# Altium project radxa_cm3_io_board_v1330.PrjPcb (part 1 of 4)
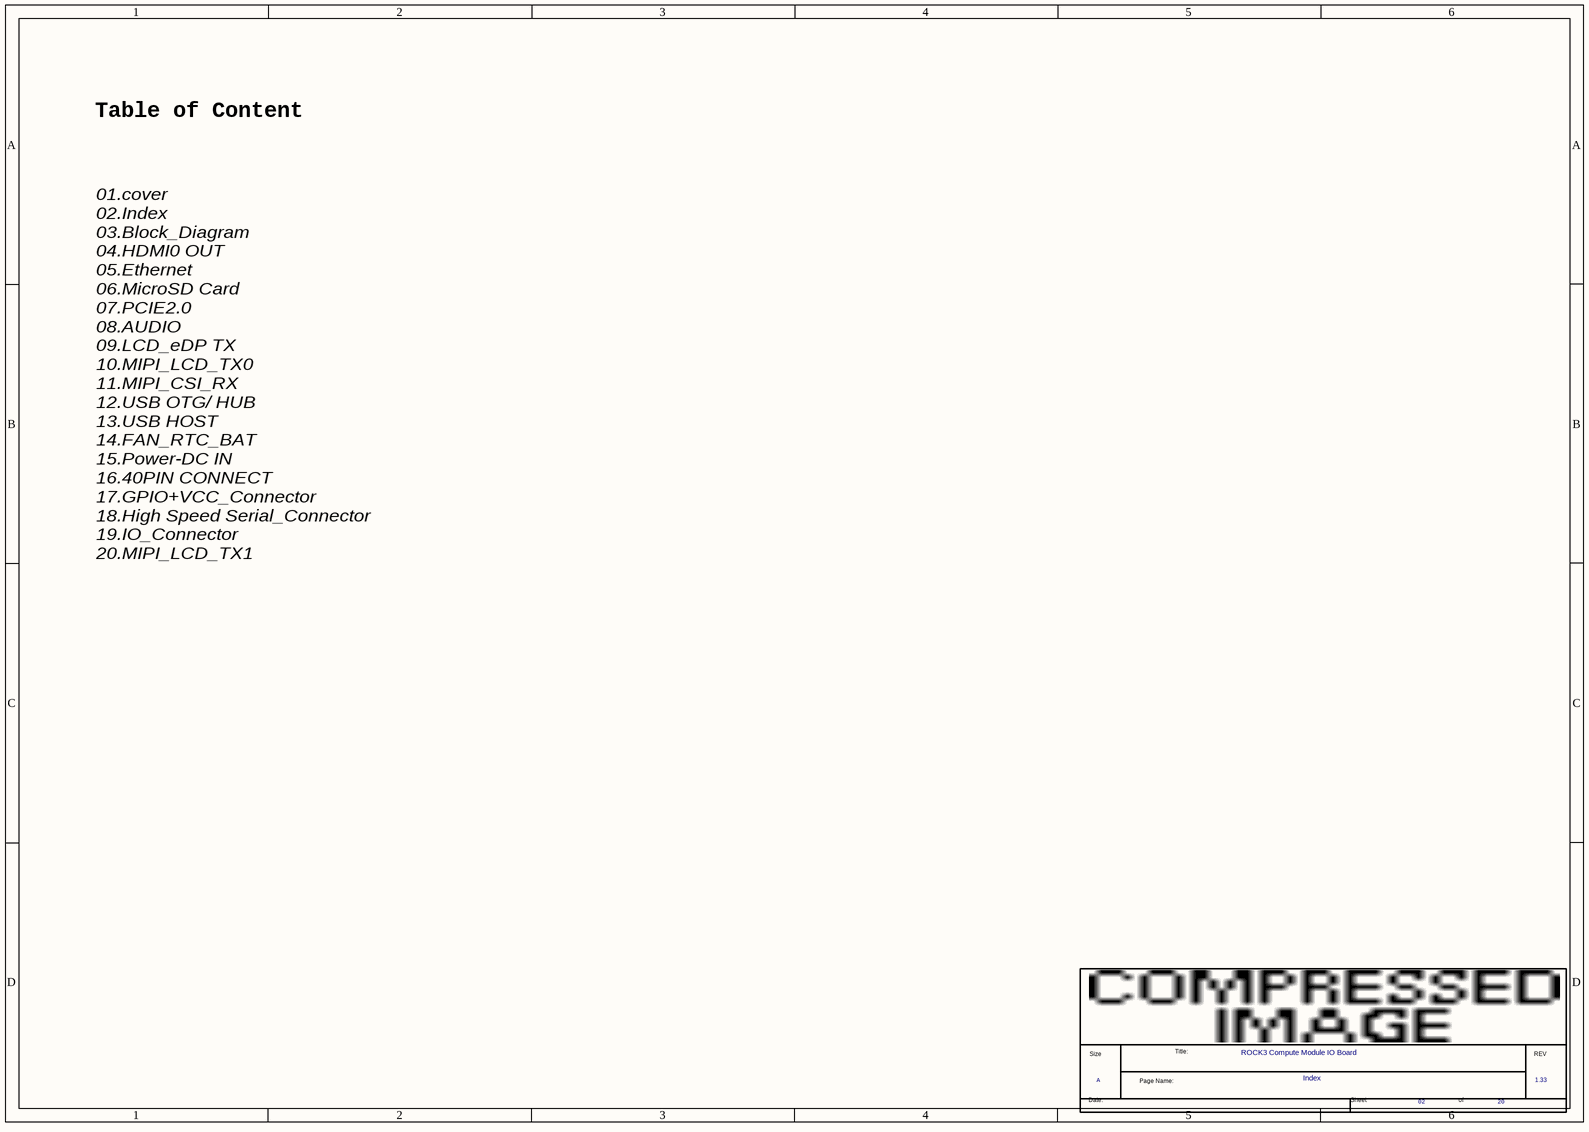
[diagram p0: 02.SchDoc]
20 sheets, 566 parts. Net scope: global (net labels, ports and power ports of the same name join across sheets).
Sheets:
  01.SchDoc
  02.SchDoc
  03.SchDoc
  04.SchDoc
  05.SchDoc
  06.SchDoc
  07.SchDoc
  08.SchDoc
  09.SchDoc
  10.SchDoc
  11.SchDoc
  12.SchDoc
  13.SchDoc
  14.SchDoc
  15.SchDoc
  16.SchDoc
  17.SchDoc
  18.SchDoc
  19.SchDoc
  20.SchDoc

## Sheet 01.SchDoc
size 297 x 209 mm

## Sheet 02.SchDoc
size 297 x 209 mm

### Parts
(Parts that share a designator on the sheet are numbered #1, #2 ... from top to bottom, then left to right.)
*#1  Page Count: 20  Page Number: 02  Page Size: A  Title: ROCK3 Compute Module IO Board  RevCode: 1.33  Doc: Index  (hidden comment: radxa_1010)  (graphical)

### Notes on the sheet
- Table of Content
- 01.cover
  02.Index
  03.Block_Diagram
  04.HDMI0 OUT
  05.Ethernet
  06.MicroSD Card
  07.PCIE2.0
  08.AUDIO
  09.LCD_eDP TX
  10.MIPI_LCD_TX0
  11.MIPI_CSI_RX
  12.USB OTG/ HUB
  13.USB HOST
  14.FAN_RTC_BAT
  15.Power-DC IN
  16.40PIN CONNECT
  17.GPIO+VCC_Connector
  18.High Speed Serial_Connector
  19.IO_Connector
  20.MIPI_LCD_TX1
- (in symbol radxa_1010) Title:; Size; REV; Page Name:; Date:; Sheet; of

### Library data of the parts
*#1 = radxa_1010: Page Create Date: March  8, 1995

## Sheet 03.SchDoc
size 500 x 350 mm
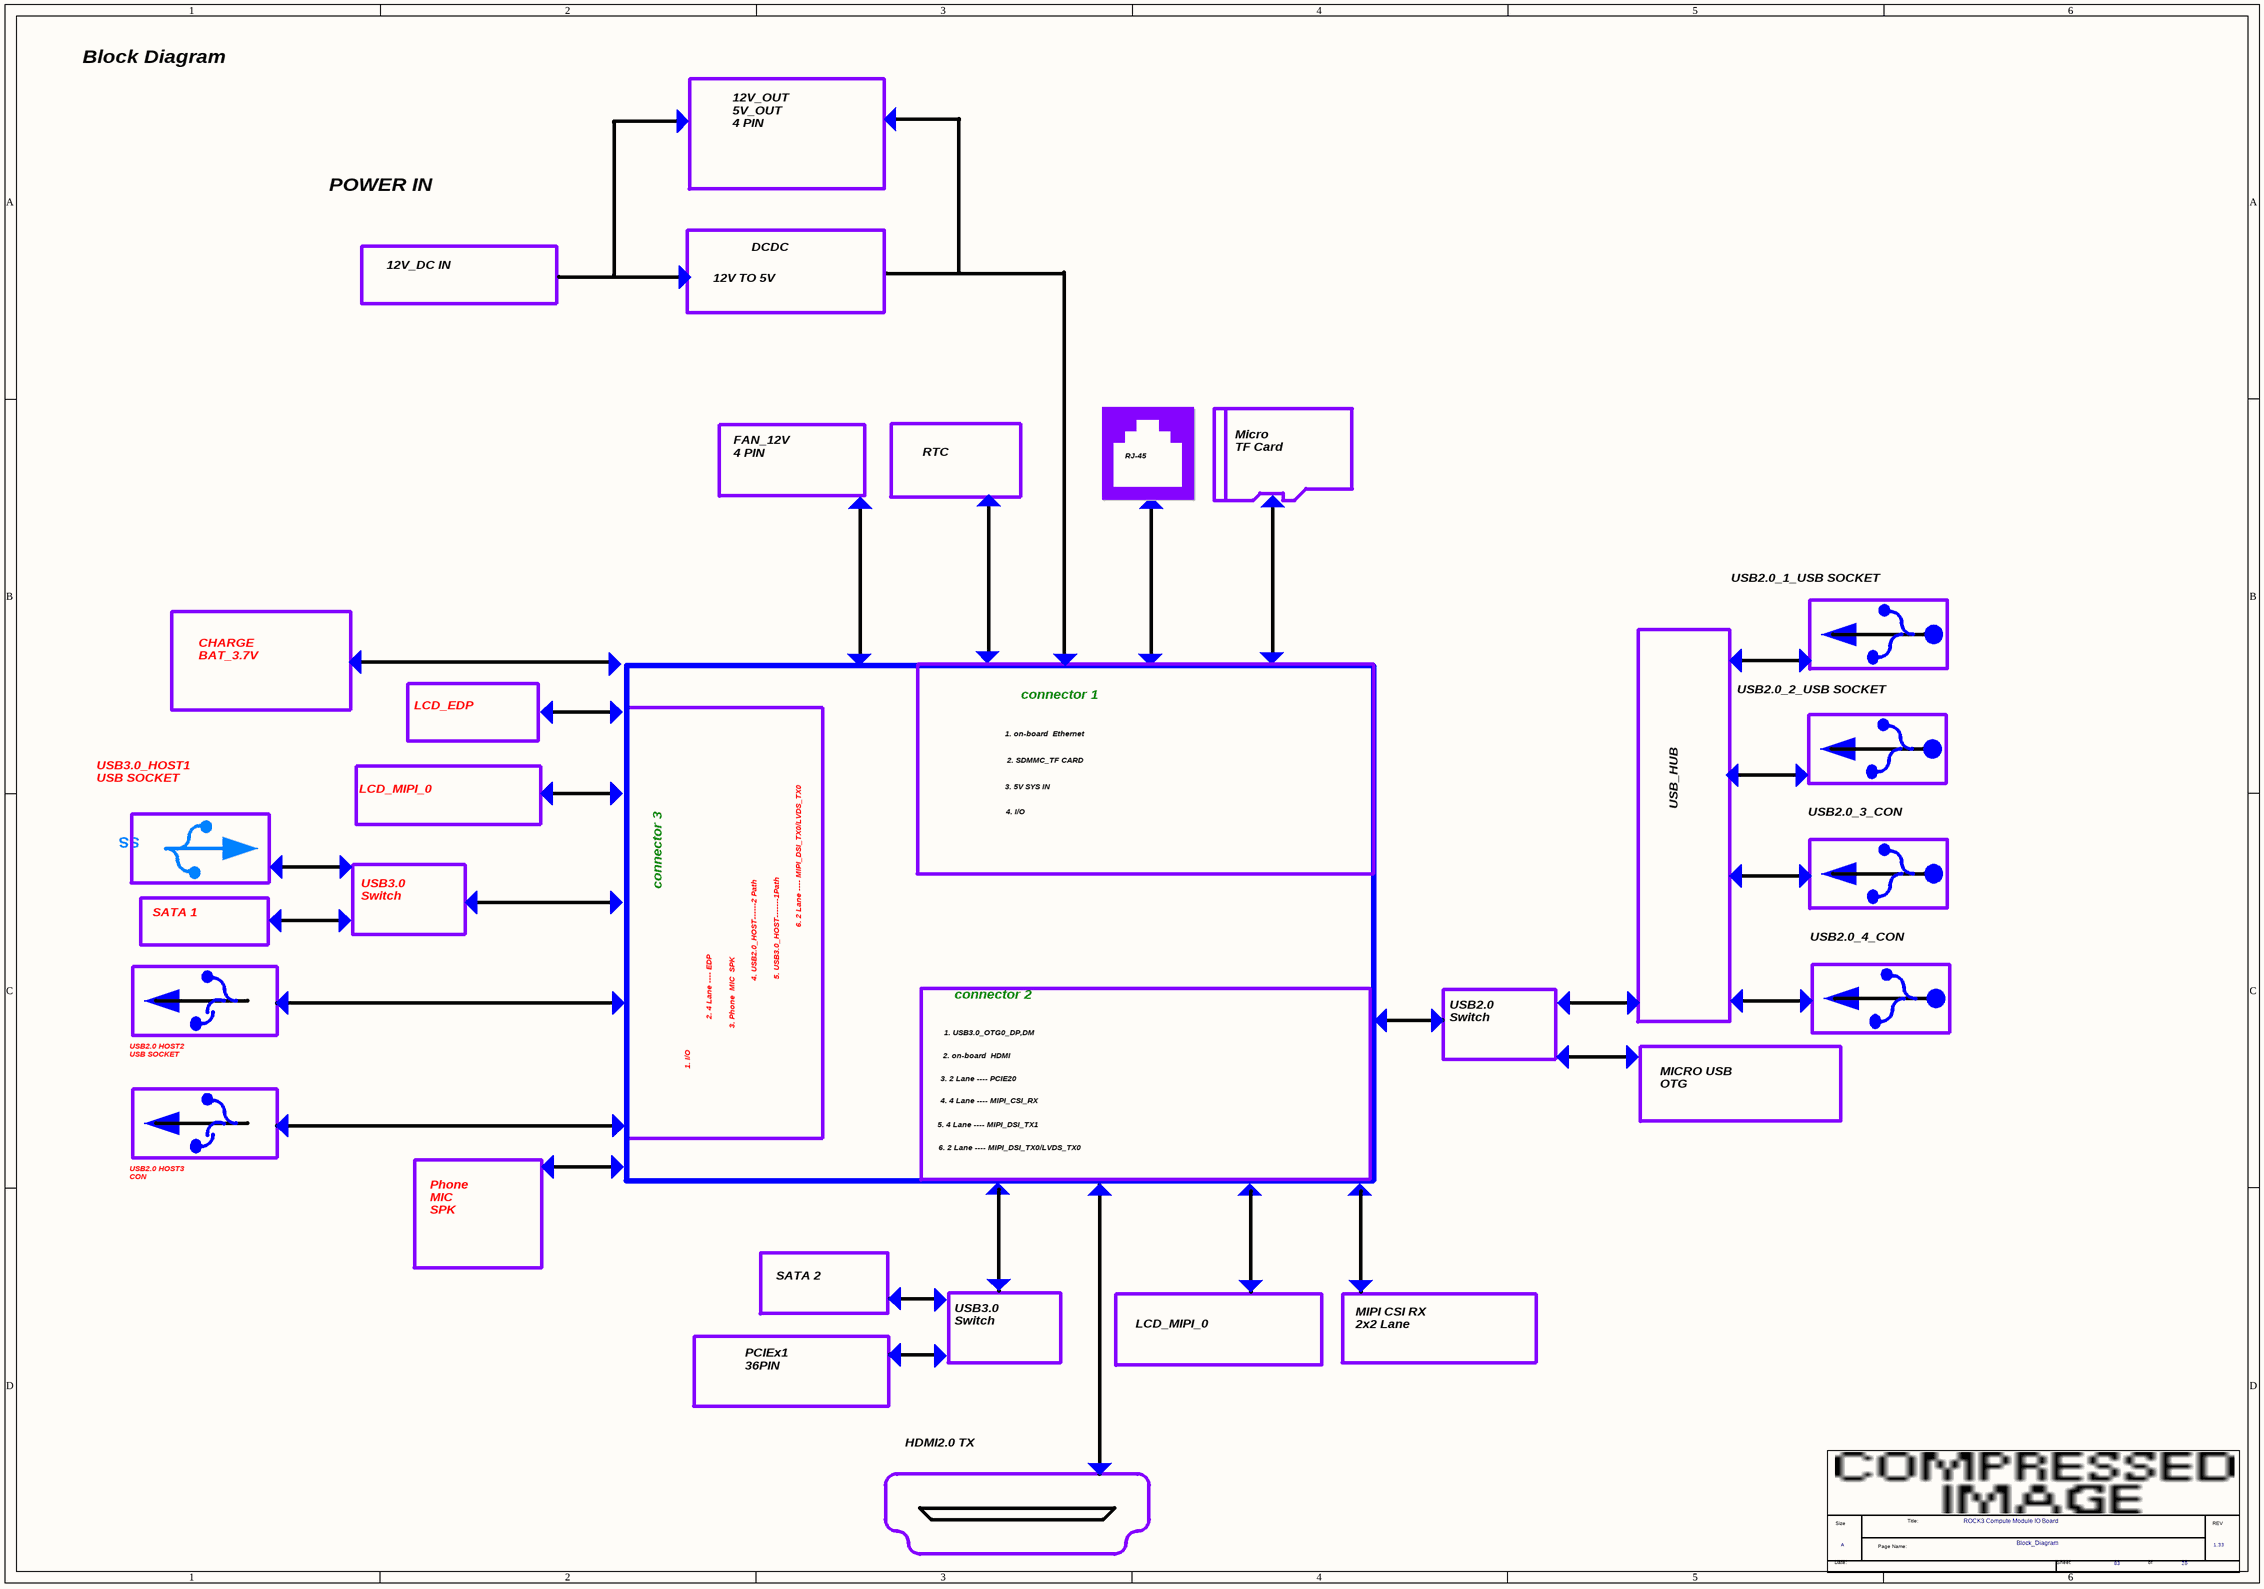
[diagram p1: 03.SchDoc]

### Parts
(Parts that share a designator on the sheet are numbered #1, #2 ... from top to bottom, then left to right.)
*#2  Page Count: 20  Page Number: 03  Page Size: A  Title: ROCK3 Compute Module IO Board  RevCode: 1.33  Doc: Block_Diagram  (hidden comment: radxa_1010)  (graphical)

### Notes on the sheet
- Block Diagram
- 12V_OUT
  5V_OUT
  4 PIN
- POWER IN
- 12V_DC IN
- 12V TO 5V
- DCDC
- FAN_12V
  4 PIN
- RTC
- RJ-45
- Micro
  TF Card
- CHARGE
  BAT_3.7V
- USB2.0_1_USB SOCKET
- LCD_EDP
- 1. on-board  Ethernet
- connector 1
- USB2.0_2_USB SOCKET
- USB3.0_HOST1
  USB SOCKET
- LCD_MIPI_0
- 3. 5V SYS IN
- 2. SDMMC_TF CARD
- USB_HUB
- SS
- 4. I/O
- USB2.0_3_CON
- SATA 1
- USB3.0
  Switch
- connector 3
- 5. USB3.0_HOST-------1Path
- 6. 2 Lane ---- MIPI_DSI_TX0/LVDS_TX0
- USB2.0_4_CON
- 2. 4 Lane ---- EDP
- 3. Phone  MIC  SPK
- 4. USB2.0_HOST------2 Path
- 1. USB3.0_OTG0_DP,DM
- connector 2
- USB2.0
  Switch
- USB2.0 HOST2
  USB SOCKET
- 1. I/O
- 3. 2 Lane ---- PCIE20
- 2. on-board  HDMI
- MICRO USB
  OTG
- 5. 4 Lane ---- MIPI_DSI_TX1
- 4. 4 Lane ---- MIPI_CSI_RX
- USB2.0 HOST3
  CON
- Phone
  MIC
  SPK
- SATA 2
- MIPI CSI RX
  2x2 Lane
- PCIEx1
  36PIN
- HDMI2.0 TX
- (in symbol radxa_1010) Size; Title:; REV; Page Name:; Date:; Sheet; of

### Library data of the parts
*#2 = radxa_1010: Page Create Date: March  8, 1995

## Sheet 04.SchDoc
size 297 x 209 mm
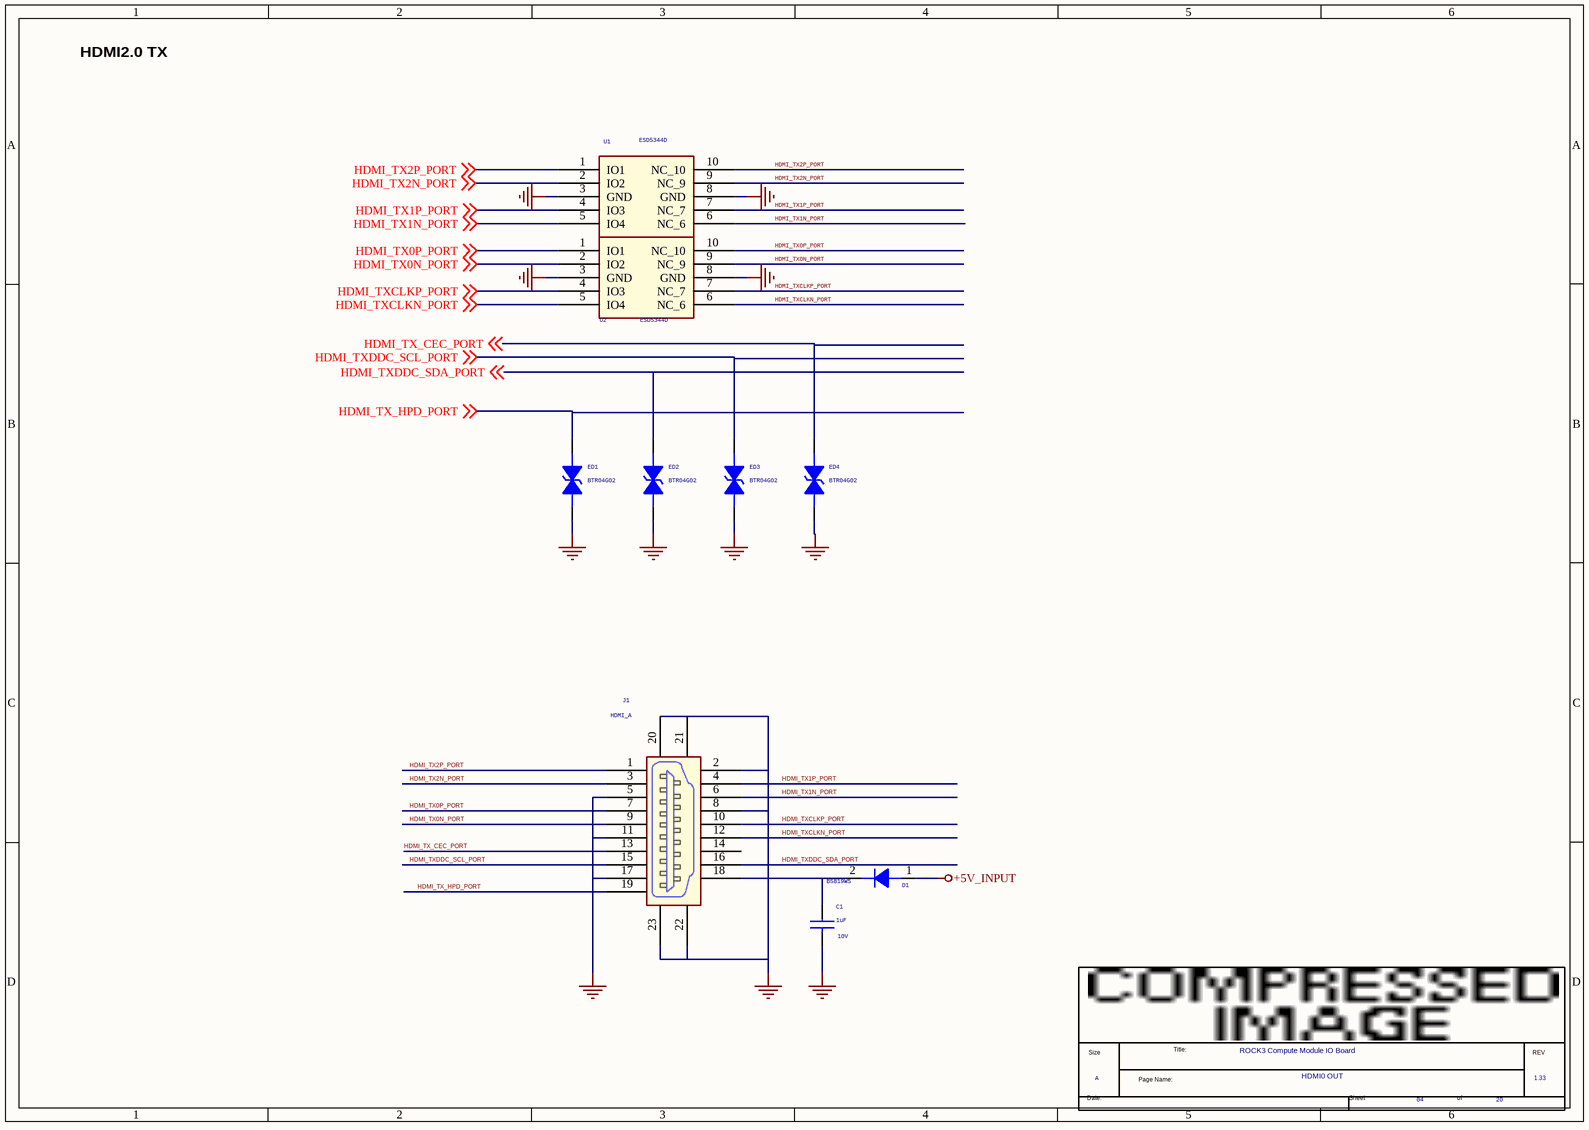
[diagram p2: 04.SchDoc]

### Parts
(Parts that share a designator on the sheet are numbered #1, #2 ... from top to bottom, then left to right.)
*#3  Page Count: 20  Page Number: 04  Page Size: A  Title: ROCK3 Compute Module IO Board  RevCode: 1.33  Doc: HDMI0 OUT  (hidden comment: radxa_1010)  (graphical)
C1  1uF  Voltage: 10V  [C0402]
D1  B5819WS  [SOD_323]
ED1  BTR04G02  [ESD0402_1xD5]
ED2  BTR04G02  [ESD0402_1xD5]
ED3  BTR04G02  [ESD0402_1xD5]
ED4  BTR04G02  [ESD0402_1xD5]
J1  HDMI_A  [HDMIA19S]
U1  ESD5344D  [SON10_2R50X1R00X0R50]
U2  ESD5344D  [SON10_2R50X1R00X0R50]

### Nets
+5V_INPUT: D1.1(A)
GND: C1.2 ED1.2 ED2.2 ED3.2 ED4.2 J1.2 J1.5 J1.8 J1.11 J1.17 J1.20 J1.21 J1.22 J1.23 U1.3(GND) U1.8(GND) U2.3(GND) U2.8(GND)
HDMI_TX0N_PORT: J1.9 U2.2(IO2) U2.9(NC_9) ; off-sheet HDMI_TX0N_PORT
HDMI_TX0P_PORT: J1.7 U2.1(IO1) U2.10(NC_10) ; off-sheet HDMI_TX0P_PORT
HDMI_TX1N_PORT: J1.6 U1.5(IO4) U1.6(NC_6) ; off-sheet HDMI_TX1N_PORT
HDMI_TX1P_PORT: J1.4 U1.4(IO3) U1.7(NC_7) ; off-sheet HDMI_TX1P_PORT
HDMI_TX2N_PORT: J1.3 U1.2(IO2) U1.9(NC_9) ; off-sheet HDMI_TX2N_PORT
HDMI_TX2P_PORT: J1.1($PIN0) U1.1(IO1) U1.10(NC_10) ; off-sheet HDMI_TX2P_PORT
HDMI_TX_CEC_PORT: ED4.1 J1.13 ; off-sheet HDMI_TX_CEC_PORT
HDMI_TX_HPD_PORT: ED1.1 J1.19 ; off-sheet HDMI_TX_HPD_PORT
HDMI_TXCLKN_PORT: J1.12 U2.5(IO4) U2.6(NC_6) ; off-sheet HDMI_TXCLKN_PORT
HDMI_TXCLKP_PORT: J1.10 U2.4(IO3) U2.7(NC_7) ; off-sheet HDMI_TXCLKP_PORT
HDMI_TXDDC_SCL_PORT: ED3.1 J1.15 ; off-sheet HDMI_TXDDC_SCL_PORT
HDMI_TXDDC_SDA_PORT: ED2.1 J1.16 ; off-sheet HDMI_TXDDC_SDA_PORT
NetC1_1: C1.1 D1.2(K) J1.18

Not connected (* = marked no-connect by the designer): J1 14

### Notes on the sheet
- HDMI2.0 TX
- (in symbol radxa_1010) Title:; Size; REV; Page Name:; Date:; Sheet; of

### Library data of the parts
C1 = CAP NP_0: cap,1.00uF,+/-10%,10V,X5R,C0402; Manufacturer: TDK; RK PN: C1005X5R1A105K050BB; Priority: A; Tolerance: 10%; Dielectric: X5R; Part Type: C0402; Manufacturer PN: C1005X5R1A105K050BB; Created by: JJJ
D1 = DIODE_Dup2: Schottky Barrier，B5819WS SOD-323; Manufacturer: 长电; Priority: A; Created by: JJJ; Manufacturer PN: B5819WS; Part Type: Schottky rectifier; RK PN: B5819WS
ED1 = DIODE BI_DIR TRIG_0: 1-Line, Bi-directional, Transient Voltage Suppressors.17.5pF.; Manufacturer PN: ESD5451N; Manufacturer: WillSemi(韦尔半导体); Priority: A; Created by: JJJ; Part Type: ESD_TVS; RK PN: ESD5451N
ED2-ED4 = DIODE BI_DIR TRIG_0: 1-Line, Bi-directional, Transient Voltage Suppressors.17.5pF.; Manufacturer: WillSemi(韦尔半导体); RK PN: ESD5451N; Priority: A; Part Type: ESD_TVS; Manufacturer PN: ESD5451N; Created by: JJJ
J1 = HDMI_A: 通用A型HDMI座,卧式,侧插; Manufacturer: 旺科达; Priority: A; RK PN: HDMI_A; Part Type: HDMI Jack; Manufacturer Part Number: HDMI_A; Created by: JJJ
U1 U2 = ESD_ESD5304D: 4-Lines, Uni-directional, Ultra-low Capacitance Transient Voltage Suppressors; Manufacturer: WillSemi(韦尔半导体); Priority: A; RK PN: ESD5304D; Part Type: ESD_TVS; Manufacturer PN: ESD5304D; Created by: JJJ
*#3 = radxa_1010: Page Create Date: March  8, 1995

## Sheet 05.SchDoc
size 297 x 209 mm
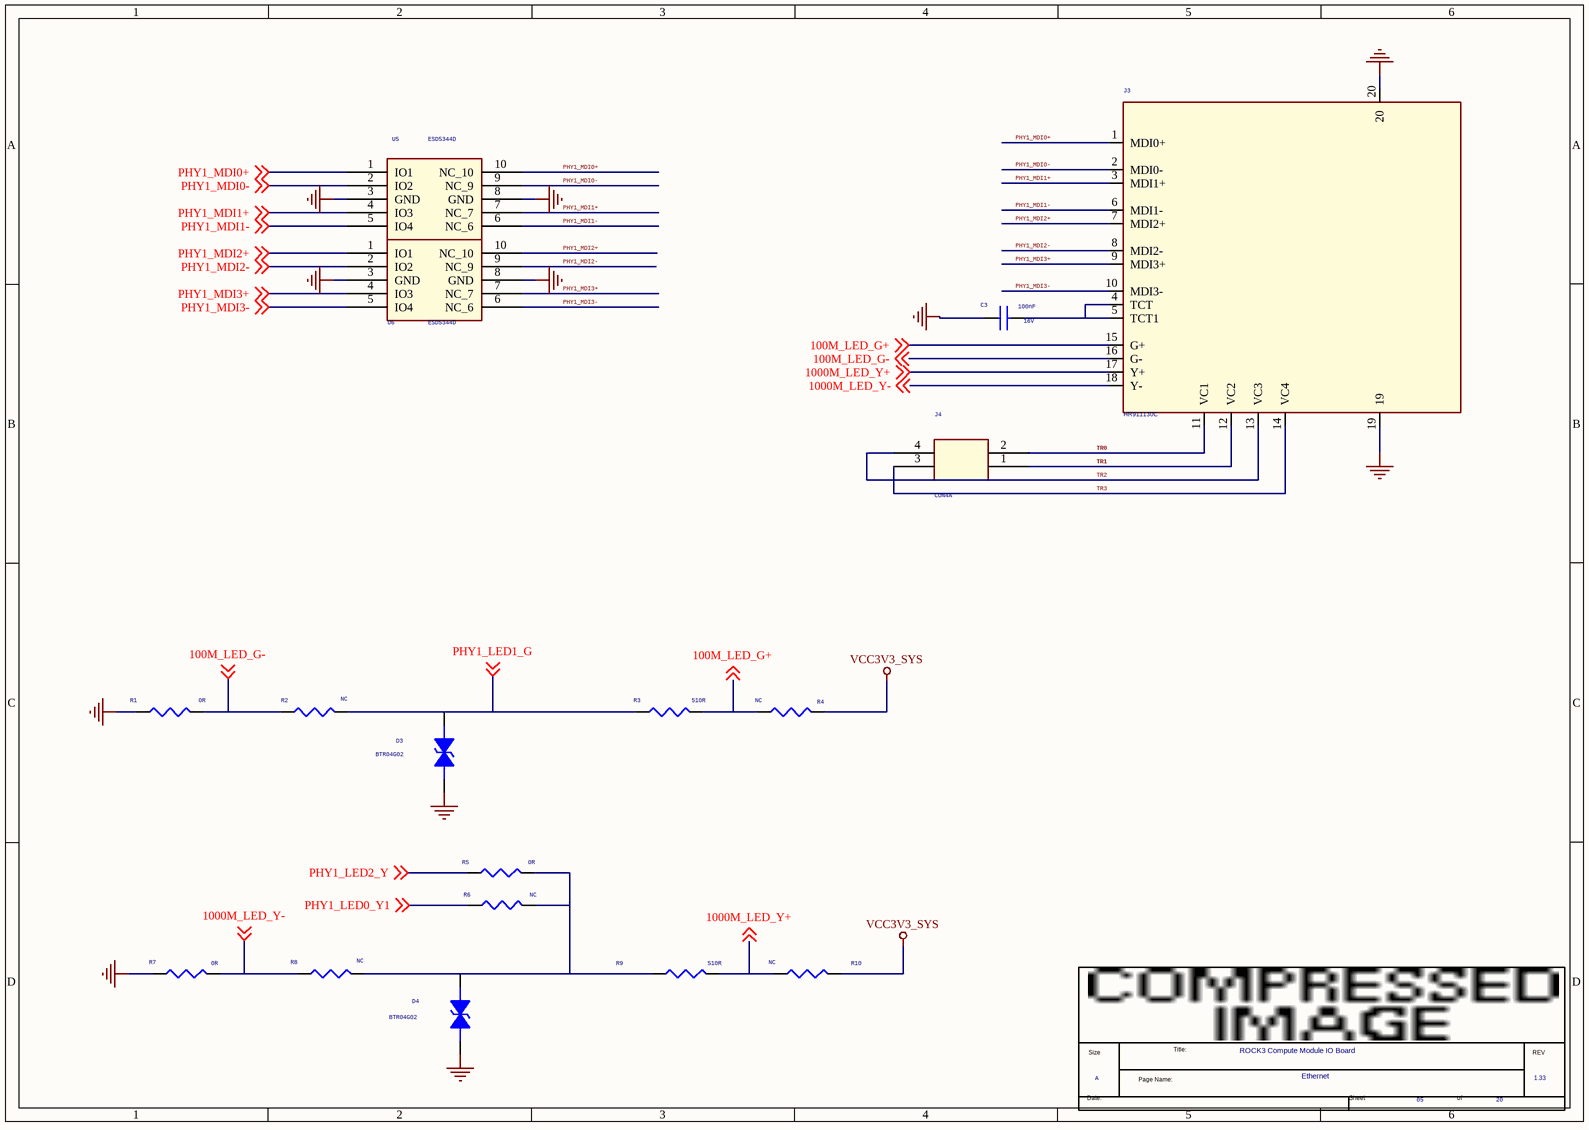
[diagram p3: 05.SchDoc]

### Parts
(Parts that share a designator on the sheet are numbered #1, #2 ... from top to bottom, then left to right.)
*#4  Page Count: 20  Page Number: 05  Page Size: A  Title: ROCK3 Compute Module IO Board  RevCode: 1.33  Doc: Ethernet  (hidden comment: radxa_1010)  (graphical)
C3  100nF  Voltage: 16V  [C0402]
D3  BTR04G02  [ESD0402_1xD5]
D4  BTR04G02  [ESD0402_1xD5]
J3  HR911130C  [RJ45_PULSE]
J4  CON4A  [DIP4PIN-2_54MM-2X2]
R1  0R  [R0402]
R2  NC  [R0402]
R3  510R  [R0402]
R4  NC  [R0402]
R5  0R  [R0402]
R6  NC  [R0402]
R7  0R  [R0402]
R8  NC  [R0402]
R9  510R  [R0402]
R10  NC  [R0402]
U5  ESD5344D  [SON10_2R50X1R00X0R50]
U6  ESD5344D  [SON10_2R50X1R00X0R50]

### Nets
GND: C3.1 D3.1 D4.1 J3.19 J3.20 R1.1 R7.1 U5.3(GND) U5.8(GND) U6.3(GND) U6.8(GND)
VCC3V3_SYS: R4.2 R10.2
100M_LED_G+: J3.15(G+) R3.2 R4.1 ; off-sheet 100M_LED_G+
100M_LED_G-: J3.16(G-) R1.2 R2.1 ; off-sheet 100M_LED_G-
1000M_LED_Y+: J3.17(Y+) R9.2 R10.1 ; off-sheet 1000M_LED_Y+
1000M_LED_Y-: J3.18(Y-) R7.2 R8.1 ; off-sheet 1000M_LED_Y-
PHY1_LED0_Y1: R6.1 ; off-sheet PHY1_LED0_Y1
PHY1_LED1_G: D3.2 R2.2 R3.1 ; off-sheet PHY1_LED1_G
PHY1_LED2_Y: R5.1 ; off-sheet PHY1_LED2_Y
PHY1_MDI0+: J3.1(MDI0+) U5.1(IO1) U5.10(NC_10) ; off-sheet PHY1_MDI0+
PHY1_MDI0-: J3.2(MDI0-) U5.2(IO2) U5.9(NC_9) ; off-sheet PHY1_MDI0-
PHY1_MDI1+: J3.3(MDI1+) U5.4(IO3) U5.7(NC_7) ; off-sheet PHY1_MDI1+
PHY1_MDI1-: J3.6(MDI1-) U5.5(IO4) U5.6(NC_6) ; off-sheet PHY1_MDI1-
PHY1_MDI2+: J3.7(MDI2+) U6.1(IO1) U6.10(NC_10) ; off-sheet PHY1_MDI2+
PHY1_MDI2-: J3.8(MDI2-) U6.2(IO2) U6.9(NC_9) ; off-sheet PHY1_MDI2-
PHY1_MDI3+: J3.9(MDI3+) U6.4(IO3) U6.7(NC_7) ; off-sheet PHY1_MDI3+
PHY1_MDI3-: J3.10(MDI3-) U6.5(IO4) U6.6(NC_6) ; off-sheet PHY1_MDI3-
TR0: J3.11(VC1) J4.2
TR1: J3.12(VC2) J4.1
TR2: J3.13(VC3) J4.4
TR3: J3.14(VC4) J4.3
NetC3_2: C3.2 J3.4(TCT) J3.5(TCT1)
NetD4_2: D4.2 R5.2 R6.2 R8.2 R9.1

### Notes on the sheet
- (in symbol radxa_1010) Title:; Size; REV; Page Name:; Date:; Sheet; of

### Library data of the parts
C3 = CAP NP_0: cap,100.00nF,+/-10%,16V,X5R,C0402; Manufacturer PN: C1005X5R1C104K050BA; Manufacturer: TDK; Tolerance: 10%; Priority: A; Dielectric: X5R; Created by: JJJ; Part Type: C0402; RK PN: C1005X5R1C104K050BA
D3 = DIODE BI_DIR TRIG_0: 1-Line, Bi-directional, Transient Voltage Suppressors.17.5pF.; Manufacturer PN: ESD5451N; Manufacturer: WillSemi(韦尔半导体); OPTION: DNP; Priority: A; Created by: JJJ; Part Type: ESD_TVS; RK PN: ESD5451N
D4 = DIODE BI_DIR TRIG_0: 1-Line, Bi-directional, Transient Voltage Suppressors.17.5pF.; Manufacturer: WillSemi(韦尔半导体); RK PN: ESD5451N; Priority: A; OPTION: DNP; Part Type: ESD_TVS; Manufacturer PN: ESD5451N; Created by: JJJ
J3 = HR911130C_1: 千兆网口接口，内置变压器; DEV: CON_PULSE_J00-61; FAB: PULSE; BOI: RJ45; DESIG: 10/100 base TX LXT971A; REF: J00-0061; Priority: A; VAL: J00-0061; Created by: JJJ; Manufacturer Part Number: HR911130C; Part Type: Ethernet Jack; RK PN: HR911130C
J4 = CON4A_0
R1 = RESISTOR_0: 通用厚膜电阻,0R,+/-5%,R0402,1/16W.; Manufacturer: YAGEO; Tolerance: 5%; RK PN: RC0402JR-070RL; Priority: A; Wattage: 1/16W; Part Type: 通用厚膜电阻; Manufacturer PN: RC0402JR-070RL; Created by: YTL
R2 R5-R8 = RESISTOR_0: 通用厚膜电阻,0R,+/-5%,R0402,1/16W.; Manufacturer PN: RC0402JR-070RL; Manufacturer: YAGEO; Tolerance: 5%; Wattage: 1/16W; Priority: A; Created by: YTL; Part Type: 通用厚膜电阻; RK PN: RC0402JR-070RL
R3 = RESISTOR_0: 通用厚膜电阻,0R,+/-5%,R0402,1/16W.; Manufacturer: YAGEO; Tolerance: 5%; RK PN: RC0402JR-070RL; Priority: A; Wattage: 1/16W; option: DNP; Part Type: 通用厚膜电阻; Manufacturer PN: RC0402JR-070RL; Created by: YTL
R4 = RESISTOR_0: 通用厚膜电阻,510R,+/-5%,R0402,1/16W.; Manufacturer PN: RC0402JR-07510RL; Manufacturer: YAGEO; Tolerance: 5%; Wattage: 1/16W; Priority: A; Created by: YTL; Part Type: 通用厚膜电阻; RK PN: RC0402JR-07510RL
R9 = RESISTOR_0: 通用厚膜电阻,0R,+/-5%,R0402,1/16W.; Manufacturer PN: RC0402JR-070RL; Manufacturer: YAGEO; Tolerance: 5%; option: DNP; Wattage: 1/16W; Priority: A; Created by: YTL; Part Type: 通用厚膜电阻; RK PN: RC0402JR-070RL
R10 = RESISTOR_0: 通用厚膜电阻,510R,+/-5%,R0402,1/16W.; Manufacturer: YAGEO; Tolerance: 5%; RK PN: RC0402JR-07510RL; Priority: A; Wattage: 1/16W; Part Type: 通用厚膜电阻; Manufacturer PN: RC0402JR-07510RL; Created by: YTL
U5 U6 = ESD_ESD5304D: as U1 on sheet 04; Created by: JJJ; Manufacturer PN: ESD5304D; Part Type: ESD_TVS; RK PN: ESD5304D
*#4 = radxa_1010: Page Create Date: March  8, 1995

## Sheet 06.SchDoc
size 297 x 209 mm
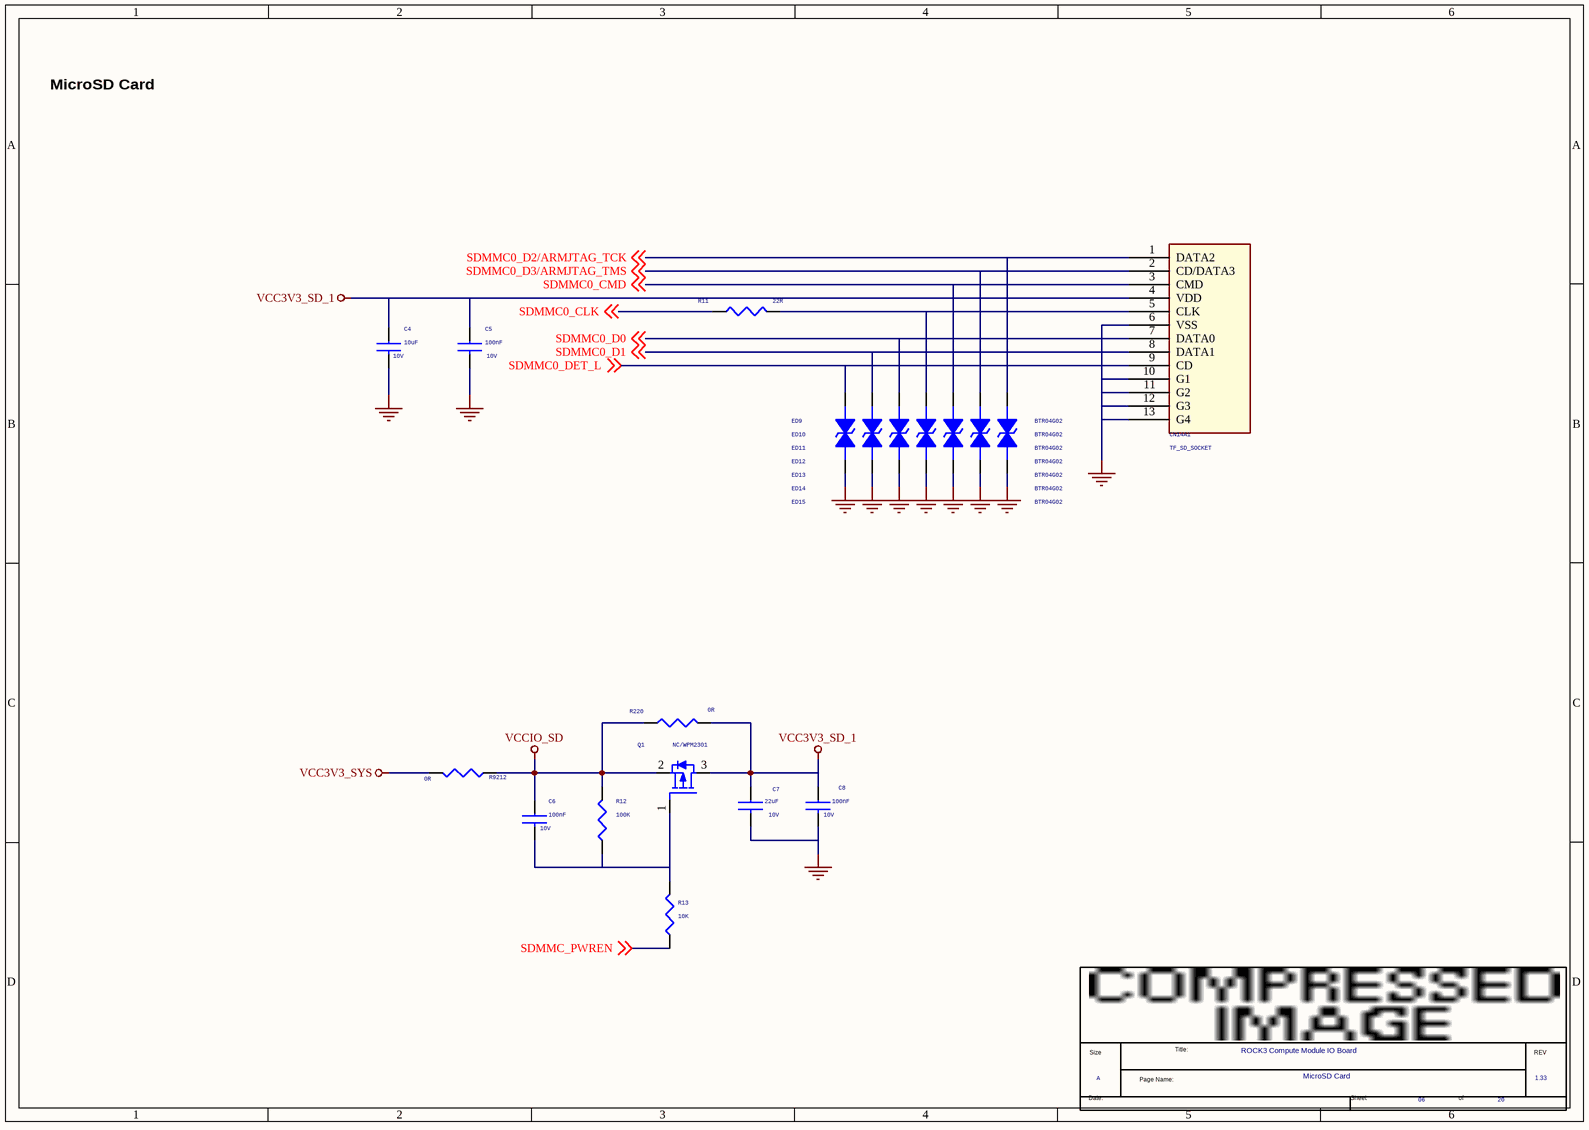
[diagram p4: 06.SchDoc]

### Parts
(Parts that share a designator on the sheet are numbered #1, #2 ... from top to bottom, then left to right.)
*#5  Page Count: 20  Page Number: 06  Page Size: A  Title: ROCK3 Compute Module IO Board  RevCode: 1.33  Doc: MicroSD Card  (hidden comment: radxa_1010)  (graphical)
C4  10uF  Voltage: 10V  [C0603]
C5  100nF  Voltage: 10V  [C0402]
C6  100nF  Voltage: 10V  [C0402]
C7  22uF  Voltage: 10V  [C0805]
C8  100nF  Voltage: 10V  [C0402]
CN14A1  TF_SD_SOCKET  [TF-CKT01-009D]
ED9  BTR04G02  [E0402N]
ED10  BTR04G02  [E0402N]
ED11  BTR04G02  [E0402N]
ED12  BTR04G02  [E0402N]
ED13  BTR04G02  [E0402N]
ED14  BTR04G02  [E0402N]
ED15  BTR04G02  [E0402N]
Q1  NC/WPM2301  [SOT23]
R11  22R  [R0402]
R12  100K  [R0402]
R13  10K  [R0402]
R220  0R  [R0402]
R9212  0R  [R0402]

### Nets
GND: C4.2 C5.2 C7.2 C8.2 CN14A1.6(VSS) CN14A1.10(G1) CN14A1.11(G2) CN14A1.12(G3) CN14A1.13(G4) ED9.2 ED10.2 ED11.2 ED12.2 ED13.2 ED14.2 ED15.2
VCC3V3_SD_1: C4.1 C5.1 C7.1 C8.1 CN14A1.4(VDD) Q1.3(DRAIN) R220.2
VCC3V3_SYS: R9212.2
VCCIO_SD: C6.1 Q1.2(SOURCE) R12.1 R220.1 R9212.1
SDMMC0_CLK: R11.1 ; off-sheet SDMMC0_CLK
SDMMC0_CMD: CN14A1.3(CMD) ED13.1 ; off-sheet SDMMC0_CMD
SDMMC0_D0: CN14A1.7(DATA0) ED11.1 ; off-sheet SDMMC0_D0
SDMMC0_D1: CN14A1.8(DATA1) ED10.1 ; off-sheet SDMMC0_D1
SDMMC0_D2/ARMJTAG_TCK: CN14A1.1(DATA2) ED15.1 ; off-sheet SDMMC0_D2/ARMJTAG_TCK
SDMMC0_D3/ARMJTAG_TMS: CN14A1.2(CD/DATA3) ED14.1 ; off-sheet SDMMC0_D3/ARMJTAG_TMS
SDMMC0_DET_L: CN14A1.9(CD) ED9.1 ; off-sheet SDMMC0_DET_L
SDMMC_PWREN: R13.2 ; off-sheet SDMMC_PWREN
NetC6_2: C6.2 Q1.1(GATE) R12.2 R13.1
NetCN14A1_5: CN14A1.5(CLK) ED12.1 R11.2

### Notes on the sheet
- MicroSD Card
- (in symbol radxa_1010) Title:; Size; REV; Page Name:; Date:; Sheet; of

### Library data of the parts
C4 = CAP NP_0: cap,10.00uF,+/-10%,10V,X5R,C0603; Manufacturer: TDK; RK PN: C1608X5R1A106K080AC; Priority: A; C_Voltage: 6.3V; Tolerance: 10%; Dielectric: X5R; Part Type: C0603; Manufacturer PN: C1608X5R1A106K080AC; Created by: JJJ
C5 = CAP NP_0: cap,100.00nF,+/-10%,10V,X5R,C0402; Manufacturer: TDK; RK PN: C1005X5R1A104K050BA; Priority: A; Tolerance: 10%; C_Voltage: 6.3V; Dielectric: X5R; Part Type: C0402; Manufacturer PN: C1005X5R1A104K050BA; Created by: JJJ
C6 = CAP NP_0: cap,100.00nF,+/-10%,16V,X5R,C0402; Manufacturer: TDK; RK PN: C1005X5R1C104K050BA; Priority: A; Tolerance: 10%; Dielectric: X5R; Part Type: C0402; Manufacturer PN: C1005X5R1C104K050BA; Created by: JJJ
C7 = CAP NP_0: cap,10.00uF,+/-10%,6.3V,X5R,C0603; Manufacturer PN: C1608X5R0J106K080AB; Manufacturer: TDK; Tolerance: 10%; Priority: A; Dielectric: X5R; Created by: JJJ; Part Type: C0603; RK PN: C1608X5R0J106K080AB
C8 = CAP NP_0: as C3 on sheet 05; Dielectric: X5R; Created by: JJJ; Part Type: C0402; RK PN: C1005X5R1C104K050BA
CN14A1 = SD_SOCKET_0
ED9-ED15 = DIODE BI-DIR TRIG: ESD
Q1 = MOSFET P_Dup1: PMOS,WPM3407-3/TR,SOT_23,Id=4.4A,Vds=30V; Manufacturer: WillSemi(韦尔半导体); Priority: A; Id_max: 4.4A; Vgs: ±20V; VDS: 30V; Vgsth: 2.0V; Pd: 0.9W; RK PN: WPM3407-3/TR; Part Type: PMOS; Manufacturer PN: WPM3407-3/TR; Created by: JJJ
R11 = RESISTOR_1
R12 = RESISTOR_0: 通用厚膜电阻,100K,+/-5%,R0402,1/16W.; Manufacturer: YAGEO; Tolerance: 5%; RK PN: RC0402JR-07100KL; Priority: A; Wattage: 1/16W; Part Type: 通用厚膜电阻; Manufacturer PN: RC0402JR-07100KL; Created by: YTL
R13 = RESISTOR_0: 通用厚膜电阻,10K,+/-5%,R0402,1/16W.; Manufacturer PN: RC0402JR-0710KL; Manufacturer: YAGEO; Tolerance: 5%; Wattage: 1/16W; Priority: A; Created by: YTL; Part Type: 通用厚膜电阻; RK PN: RC0402JR-0710KL
R220 = RESISTOR_0: as R1 on sheet 05; Part Type: 通用厚膜电阻; Manufacturer PN: RC0402JR-070RL; Created by: YTL
R9212 = RESISTOR_0: 通用厚膜电阻,100R,+/-5%,R0402,1/16W.; Manufacturer: YAGEO; Tolerance: 5%; RK PN: RC0402JR-07100RL; Priority: A; Wattage: 1/16W; Part Type: 通用厚膜电阻; Manufacturer PN: RC0402JR-07100RL; Created by: YTL
*#5 = radxa_1010: Page Create Date: March  8, 1995

## Sheet 07.SchDoc
size 386 x 246 mm
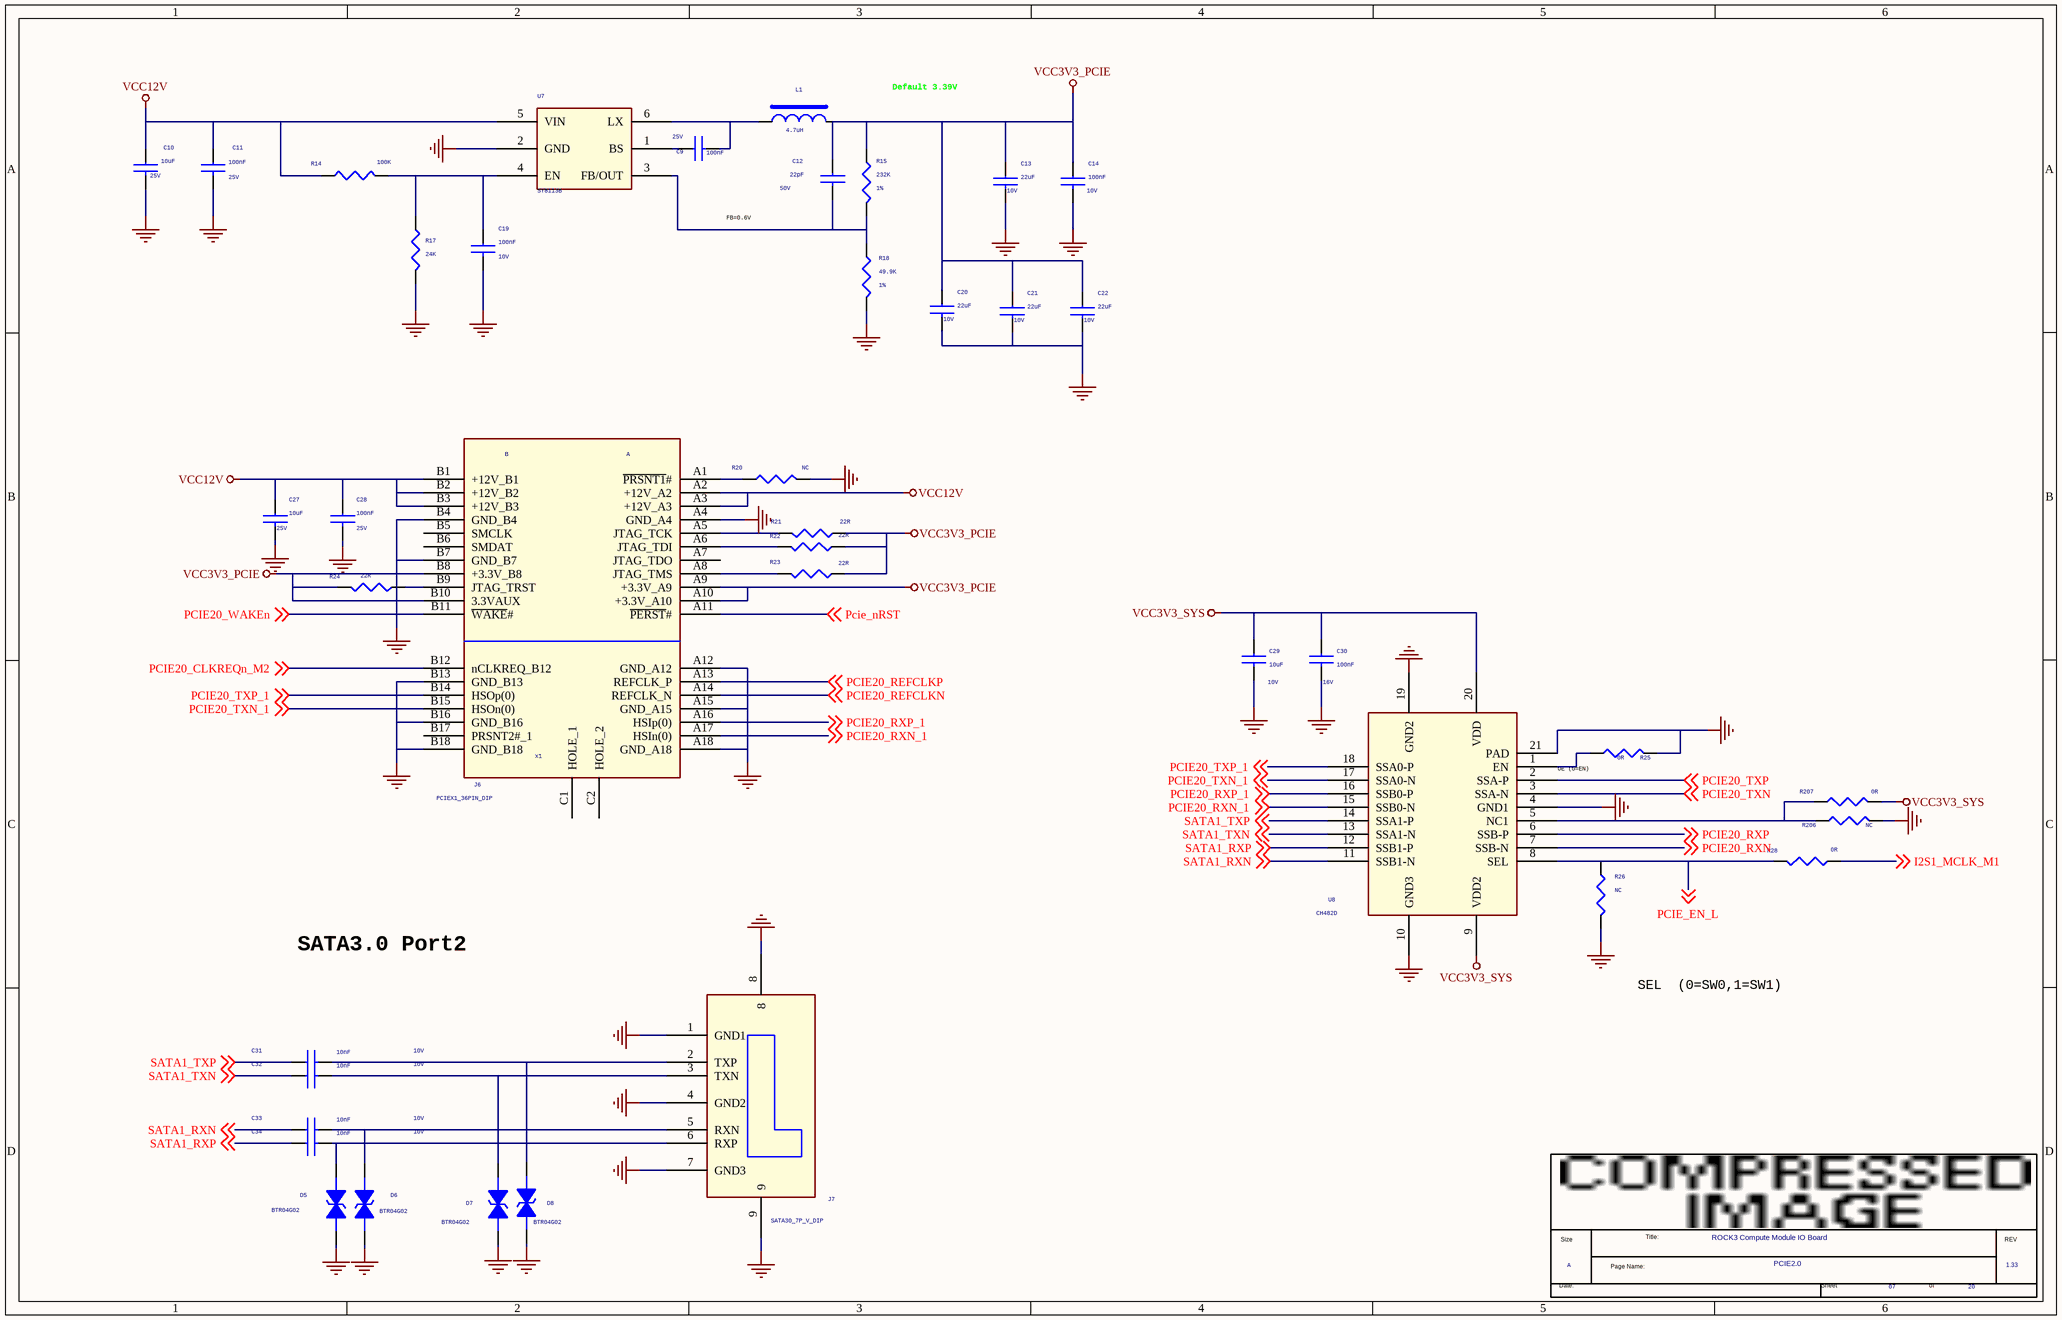
[diagram p5: 07.SchDoc]

### Parts
(Parts that share a designator on the sheet are numbered #1, #2 ... from top to bottom, then left to right.)
*#6  Page Count: 20  Page Number: 07  Page Size: A  Title: ROCK3 Compute Module IO Board  RevCode: 1.33  Doc: PCIE2.0  (hidden comment: radxa_1010)  (graphical)
C9  100nF  Voltage: 25V  [C0402]
C10  10uF  Voltage: 25V  [C1206]
C11  100nF  Voltage: 25V  [C0402]
C12  22pF  Voltage: 50V  [C0402]
C13  22uF  Voltage: 10V  [C0805]
C14  100nF  Voltage: 10V  [C0402]
C19  100nF  Voltage: 10V  [C0402]
C20  22uF  Voltage: 10V  [C0805]
C21  22uF  Voltage: 10V  [C0805]
C22  22uF  Voltage: 10V  [C0805]
C27  10uF  Voltage: 25V  [C1206]
C28  100nF  Voltage: 25V  [C0402]
C29  10uF  Voltage: 10V  [C0603]
C30  100nF  Voltage: 16V  [C0402]
C31  10nF  Voltage: 10V  [C0402]
C32  10nF  Voltage: 10V  [C0402]
C33  10nF  Voltage: 10V  [C0402]
C34  10nF  Voltage: 10V  [C0402]
D5  BTR04G02  [ESD0402_1xD5]
D6  BTR04G02  [ESD0402_1xD5]
D7  BTR04G02  [ESD0402_1xD5]
D8  BTR04G02  [ESD0402_1xD5]
J6  PCIEX1_36PIN_DIP  [PCIEX1_36PIN_DIP]
J7  SATA30_7P_V_DIP  [SMD_SATA_7P_50_180]
L1  4.7uH  [IND-5020]
R14  100K  [R0402]
R15  232K  Tolerance: 1%  [R0402]
R17  24K  [R0402]
R18  49.9K  Tolerance: 1%  [R0402]
R20  NC  [R0402]
R21  22R  [R0402]
R22  22R  [R0402]
R23  22R  [R0402]
R24  22R  [R0402]
R25  0R  [R0402]
R26  NC  [R0402]
R28  0R  [R0402]
R206  NC  [R0402]
R207  0R  [R0402]
U7  SY8113B  [SOT_23_6]
U8  CH482D  [CH482X]

### Nets
GND: C10.2 C11.2 C13.2 C14.2 C19.2 C20.2 C21.2 C22.2 C27.2 C28.2 C29.2 C30.2 D5.1 D6.1 D7.1 D8.1 J6.A4(GND_A4) J6.A12(GND_A12) J6.A15(GND_A15) J6.A18(GND_A18) J6.B4(GND_B4) J6.B7(GND_B7) J6.B13(GND_B13) J6.B16(GND_B16) J6.B18(GND_B18) J7.1(GND1) J7.4(GND2) J7.7(GND3) J7.8 J7.9 R17.2 R18.2 R20.2 R25.1 R26.2 R206.1 U7.2(GND) U8.4(GND1) U8.10(GND3) U8.19(GND2) U8.21(PAD)
VCC3V3_PCIE: C12.1 C13.1 C14.1 C20.1 C21.1 C22.1 J6.A9(+3.3V_A9) J6.A10(+3.3V_A10) J6.B8(+3.3V_B8) J6.B10(3.3VAUX) L1.2 R15.1 R21.2 R22.2 R23.2 R24.1
VCC3V3_SYS: C29.1 C30.1 R207.1 U8.9(VDD2) U8.20(VDD)
VCC12V: C10.1 C11.1 C27.1 C28.1 J6.A2(+12V_A2) J6.A3(+12V_A3) J6.B1(+12V_B1) J6.B2(+12V_B2) J6.B3(+12V_B3) R14.1 U7.5(VIN)
I2S1_MCLK_M1: R28.2 ; off-sheet I2S1_MCLK_M1
PCIE20_CLKREQn_M2: J6.B12(nCLKREQ_B12) ; off-sheet PCIE20_CLKREQn_M2
PCIE20_REFCLKN: J6.A14(REFCLK_N) ; off-sheet PCIE20_REFCLKN
PCIE20_REFCLKP: J6.A13(REFCLK_P) ; off-sheet PCIE20_REFCLKP
PCIE20_RXN: U8.7(SSB-N) ; off-sheet PCIE20_RXN
PCIE20_RXN_1: J6.A17(HSIn(0)) U8.15(SSB0-N) ; off-sheet PCIE20_RXN_1
PCIE20_RXP: U8.6(SSB-P) ; off-sheet PCIE20_RXP
PCIE20_RXP_1: J6.A16(HSIp(0)) U8.16(SSB0-P) ; off-sheet PCIE20_RXP_1
PCIE20_TXN: U8.3(SSA-N) ; off-sheet PCIE20_TXN
PCIE20_TXN_1: J6.B15(HSOn(0)) U8.17(SSA0-N) ; off-sheet PCIE20_TXN_1
PCIE20_TXP: U8.2(SSA-P) ; off-sheet PCIE20_TXP
PCIE20_TXP_1: J6.B14(HSOp(0)) U8.18(SSA0-P) ; off-sheet PCIE20_TXP_1
PCIE20_WAKEn: J6.B11(~{WAKE}#) ; off-sheet PCIE20_WAKEn
PCIE_EN_L: R26.1 R28.1 U8.8(SEL) ; off-sheet PCIE_EN_L
Pcie_nRST: J6.A11(~{PERST}#) ; off-sheet Pcie_nRST
SATA1_RXN: C33.1 U8.11(SSB1-N) ; off-sheet SATA1_RXN
SATA1_RXP: C34.1 U8.12(SSB1-P) ; off-sheet SATA1_RXP
SATA1_TXN: C32.1 U8.13(SSA1-N) ; off-sheet SATA1_TXN
SATA1_TXP: C31.1 U8.14(SSA1-P) ; off-sheet SATA1_TXP
NetC9_1: C9.1 U7.1(BS)
NetC9_2: C9.2 L1.1 U7.6(LX)
NetC12_2: C12.2 R15.2 R18.1 U7.3(FB/OUT)
NetC19_1: C19.1 R14.2 R17.1 U7.4(EN)
NetC31_2: C31.2 D8.2 J7.2(TXP)
NetC32_2: C32.2 D7.2 J7.3(TXN)
NetC33_2: C33.2 D6.2 J7.5(RXN)
NetC34_2: C34.2 D5.2 J7.6(RXP)
NetJ6_A1: J6.A1(~{PRSNT1}#) R20.1
NetJ6_A5: J6.A5(JTAG_TCK) R21.1
NetJ6_A6: J6.A6(JTAG_TDI) R22.1
NetJ6_A8: J6.A8(JTAG_TMS) R23.1
NetJ6_B9: J6.B9(JTAG_TRST) R24.2
NetR25_2: R25.2 U8.1(EN)
NetR206_2: R206.2 R207.2 U8.5(NC1)

Not connected (* = marked no-connect by the designer): J6 A7(JTAG_TDO) B5(SMCLK) B6(SMDAT) B17(PRSNT2#_1) C1(HOLE_1) C2(HOLE_2)

### Notes on the sheet
- Default 3.39V
- FB=0.6V
- (near R25) OE (0=EN)
- SATA3.0 Port2
- SEL  (0=SW0,1=SW1)
- (in symbol PCIE_4X_CON_1) B; x1
- (in symbol radxa_1010) Title:; Size; REV; Page Name:; Date:; Sheet; of

### Library data of the parts
C9 = CAP NP_0: cap,100.00nF,+/-10%,25V,X5R,C0402; Manufacturer: TDK; Number: 37; RK PN: C1005X5R1E104K050BC; Priority: A; Tolerance: 10%; C_Voltage: 6.3V; Dielectric: X5R; Part Type: C0402; Manufacturer PN: C1005X5R1E104K050BC; Created by: JJJ
C10 = CAP NP_0: cap,10.00uF,+/-10%,25V,X5R,C1206; Manufacturer: TDK; RK PN: C3216X5R1E106K085AC; Priority: A; C_Voltage: 6.3V; Tolerance: 10%; Dielectric: X5R; Part Type: C1206; Manufacturer PN: C3216X5R1E106K085AC; Created by: JJJ
C11 = CAP NP_0: cap,100.00nF,+/-10%,25V,X5R,C0402; Manufacturer PN: C1005X5R1E104K050BC; Manufacturer: TDK; Tolerance: 10%; Priority: A; Dielectric: X5R; Created by: JJJ; Part Type: C0402; RK PN: C1005X5R1E104K050BC
C12 = CAP NP_0: cap,22.00pF,+/-5%,50V,C0G,C0402; Manufacturer: TDK; RK PN: C1005C0G1H220J050BA; Priority: A; Tolerance: 5%; Dielectric: C0G; Part Type: C0402; Manufacturer PN: C1005C0G1H220J050BA; Created by: JJJ
C13 C21 C22 = CAP NP_0: cap,22.00uF,+/-10%,10V,X5R,C0805; Manufacturer: TDK; RK PN: C2012X5R1A226K125AB; Priority: A; C_Voltage: 6.3V; Tolerance: 10%; Dielectric: X5R; Part Type: C0805; Manufacturer PN: C2012X5R1A226K125AB; Created by: JJJ
C14 = CAP NP_0: cap,100.00nF,+/-10%,10V,X5R,C0402; Manufacturer: TDK; Number: 37; RK PN: C1005X5R1A104K050BA; Priority: A; Tolerance: 10%; C_Voltage: 6.3V; Dielectric: X5R; Part Type: C0402; Manufacturer PN: C1005X5R1A104K050BA; Created by: JJJ
C19 = CAP NP_0: cap,100.00nF,+/-10%,10V,X5R,C0402; Manufacturer PN: C1005X5R1A104K050BA; Manufacturer: TDK; C_Voltage: 6.3V; Tolerance: 10%; Priority: A; Number: 37; Dielectric: X5R; Created by: JJJ; Part Type: C0402; RK PN: C1005X5R1A104K050BA
C20 = CAP NP_0: cap,22.00uF,+/-10%,10V,X5R,C0805; Manufacturer PN: C2012X5R1A226K125AB; Manufacturer: TDK; Tolerance: 10%; C_Voltage: 6.3V; Priority: A; Dielectric: X5R; Created by: JJJ; Part Type: C0805; RK PN: C2012X5R1A226K125AB
C27 = CAP NP_0: cap,10.00uF,+/-10%,25V,X5R,C1206; Manufacturer PN: C3216X5R1E106K085AC; Manufacturer: TDK; Tolerance: 10%; C_Voltage: 6.3V; Priority: A; Dielectric: X5R; Created by: JJJ; Part Type: C1206; RK PN: C3216X5R1E106K085AC
C28 = CAP NP_0: cap,100.00nF,+/-10%,25V,X5R,C0402; Manufacturer: TDK; RK PN: C1005X5R1E104K050BC; Priority: A; Tolerance: 10%; Dielectric: X5R; Part Type: C0402; Manufacturer PN: C1005X5R1E104K050BC; Created by: JJJ
C29 = CAP NP_0: cap,22.00uF,+/-10%,10V,X5R,C0805; Manufacturer: TDK; RK PN: C2012X5R1A226K125AB; Priority: A; Tolerance: 10%; Dielectric: X5R; Part Type: C0805; Manufacturer PN: C2012X5R1A226K125AB; Created by: JJJ
C30 = CAP NP_0: as C6 on sheet 06; Dielectric: X5R; Part Type: C0402; Manufacturer PN: C1005X5R1C104K050BA; Created by: JJJ
C31-C34 = CAP NP_0: cap,10.00nF,+/-10%,10V,X7R,C0201; Manufacturer PN: C0603X7R1A103K030BA; Manufacturer: TDK; Tolerance: 10%; Priority: A; Dielectric: X7R; Created by: JJJ; Part Type: C0201; RK PN: C0603X7R1A103K030BA
D5 D6 = DIODE BI_DIR TRIG_0: as D4 on sheet 05; Part Type: ESD_TVS; Manufacturer PN: ESD5451N; Created by: JJJ
D7 D8 = DIODE BI_DIR TRIG_0: as D3 on sheet 05; Created by: JJJ; Part Type: ESD_TVS; RK PN: ESD5451N
J6 = PCIE_4X_CON_1: PCIE 4X座子，立式，SMT；; Manufacturer Part Number: PCIE64_SMT; Priority: A; Part Type: PCIE; RK PN: PCIE64_SMT
J7 = SATA_DIP_1
L1 = INDUCTORS OF FERRITE_Dup1: Power Inductor,4.7uH,0.2,IND_606045; Manufacturer PN: SWPA6045S4R7MT; Manufacturer: sunlord; Isat: 4.97A; DC Resistor: 0.02ohm; Resonace frequency: 24M; Irms: 3.3A; Tolerance: 20%; Priority: A; Created by: YWQ; Part Type: POWER_IND; RK PN: SWPA6045S4R7MT
R14 = RESISTOR_0: 通用厚膜电阻,100K,+/-5%,R0402,1/16W.; Manufacturer PN: RC0402JR-07100KL; Manufacturer: YAGEO; Tolerance: 5%; Wattage: 1/16W; Priority: A; Created by: YTL; Part Type: 通用厚膜电阻; RK PN: RC0402JR-07100KL
R15 = RESISTOR_0: 通用厚膜电阻,232K,+/-1%,R0402,1/16W.; Manufacturer: YAGEO; RK PN: RC0402FR-07232KL; Priority: A; Wattage: 1/16W; Part Type: 通用厚膜电阻; Manufacturer PN: RC0402FR-07232KL; Created by: YTL
R17 = RESISTOR_0: 通用厚膜电阻,24K,+/-5%,R0402,1/16W.; Manufacturer: YAGEO; Tolerance: 5%; RK PN: RC0402JR-0724KL; Priority: A; Wattage: 1/16W; Part Type: 通用厚膜电阻; Manufacturer PN: RC0402JR-0724KL; Created by: YTL
R18 = RESISTOR_0: 通用厚膜电阻,49K9,+/-1%,R0402,1/16W.; Manufacturer PN: RC0402FR-0749K9L; Manufacturer: YAGEO; Wattage: 1/16W; Priority: A; Created by: YTL; Part Type: 通用厚膜电阻; RK PN: RC0402FR-0749K9L
R20 R206 = RESISTOR_0: as R1 on sheet 05; Part Type: 通用厚膜电阻; Manufacturer PN: RC0402JR-070RL; Created by: YTL
R21 R22 R24 = RESISTOR_0: as R13 on sheet 06; Created by: YTL; Part Type: 通用厚膜电阻; RK PN: RC0402JR-0710KL
R23 = RESISTOR_0: 通用厚膜电阻,10K,+/-5%,R0402,1/16W.; Manufacturer: YAGEO; Tolerance: 5%; RK PN: RC0402JR-0710KL; Priority: A; Wattage: 1/16W; Part Type: 通用厚膜电阻; Manufacturer PN: RC0402JR-0710KL; Created by: YTL
R25 R207 = RESISTOR_0: as R2 on sheet 05; Created by: YTL; Part Type: 通用厚膜电阻; RK PN: RC0402JR-070RL
R26 = RESISTOR_0: 通用厚膜电阻,4K7,+/-5%,R0402,1/16W.; Manufacturer: YAGEO; Tolerance: 5%; RK PN: RC0402JR-074K7L; Priority: A; Wattage: 1/16W; Part Type: 通用厚膜电阻; Manufacturer PN: RC0402JR-074K7L; Created by: YTL
R28 = RESISTOR_0: 通用厚膜电阻,100R,+/-5%,R0402,1/16W.; Manufacturer PN: RC0402JR-07100RL; Manufacturer: YAGEO; Tolerance: 5%; Wattage: 1/16W; Priority: A; Created by: YTL; Part Type: 通用厚膜电阻; RK PN: RC0402JR-07100RL
U7 = DCDC_SY8113: Manufacturer: Silergy（矽力杰）; Priority: A; Created by: JJJ; Manufacturer PN: SY8113B; Part Type: DCDC; RK PN: SY8113B
U8 = CH482X
*#6 = radxa_1010: Page Create Date: March  8, 1995

## Sheet 08.SchDoc
size 246 x 182 mm
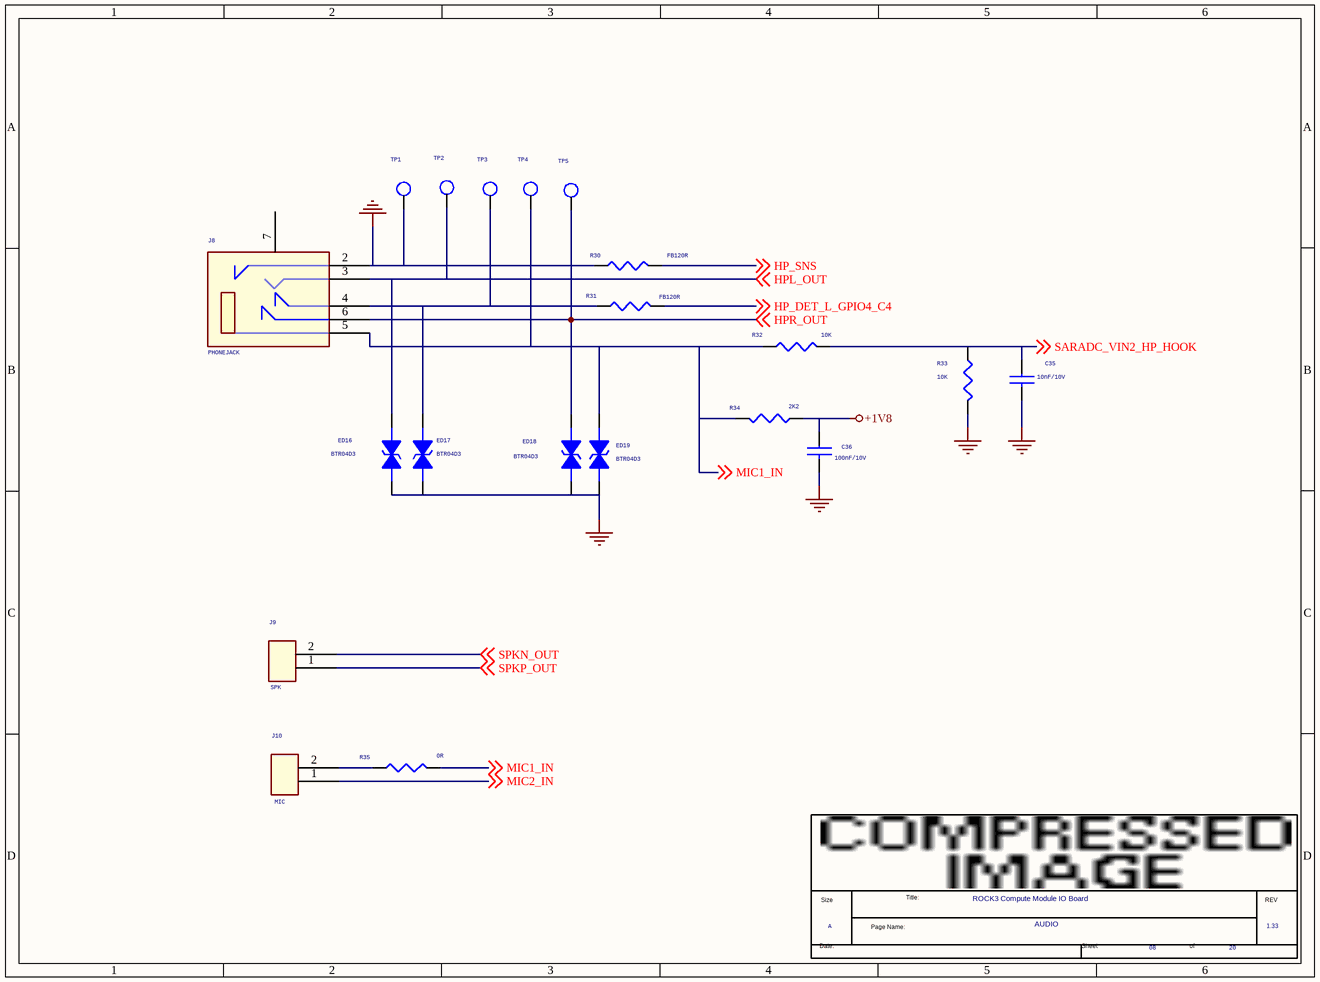
[diagram p6: 08.SchDoc]

### Parts
(Parts that share a designator on the sheet are numbered #1, #2 ... from top to bottom, then left to right.)
*#7  Page Count: 20  Page Number: 08  Page Size: A  Title: ROCK3 Compute Module IO Board  RevCode: 1.33  Doc: AUDIO  (hidden comment: radxa_1010)  (graphical)
C35  10nF/10V  [C0402]
C36  100nF/10V  [C0402]
ED16  BTR04D3  [ESD0402_1xD5]
ED17  BTR04D3  [ESD0402_1xD5]
ED18  BTR04D3  [ESD0402_1xD5]
ED19  BTR04D3  [ESD0402_1xD5]
J8  PHONEJACK  [PJ-327A]
J9  SPK  [DIP2PIN-2P54MM]
J10  MIC  [DIP2PIN-2P54MM]
R30  FB120R  [R0402]
R31  FB120R  [R0402]
R32  10K  [R0402]
R33  10K  [R0402]
R34  2K2  [R0402]
R35  0R  [R0402]
TP1  TP_0.7  [TEST]  (value not drawn)
TP2  TP_0.7  [TEST]  (value not drawn)
TP3  TP_0.7  [TEST]  (value not drawn)
TP4  TP_0.7  [TEST]  (value not drawn)
TP5  TP_0.7  [TEST]  (value not drawn)

### Nets
+1V8: C36.1 R34.2
GND: C35.2 C36.2 ED16.2 ED17.2 ED18.2 ED19.2 J8.2(DH) R30.1 R33.1 TP1.1
HP_DET_L_GPIO4_C4: R31.2 ; off-sheet HP_DET_L_GPIO4_C4
HP_SNS: R30.2 ; off-sheet HP_SNS
HPL_OUT: ED16.1 J8.3(R) TP2.1 ; off-sheet HPL_OUT
HPR_OUT: ED18.1 J8.6(HP) TP5.1 ; off-sheet HPR_OUT
MIC1_IN: ED19.1 J8.5(D) R32.2 R34.1 R35.2 TP4.1 ; off-sheet MIC1_IN
MIC2_IN: J10.1 ; off-sheet MIC2_IN
SARADC_VIN2_HP_HOOK: C35.1 R32.1 R33.2 ; off-sheet SARADC_VIN2_HP_HOOK
SPKN_OUT: J9.2 ; off-sheet SPKN_OUT
SPKP_OUT: J9.1 ; off-sheet SPKP_OUT
NetED17_1: ED17.1 J8.4(L) R31.1 TP3.1
NetJ10_2: J10.2 R35.1

Not connected (* = marked no-connect by the designer): J8 7(NC2)

### Notes on the sheet
- (in symbol radxa_1010) Size; Title:; REV; Page Name:; Date:; Sheet; of

### Library data of the parts
C35 = CAP: RoHS CHIP CAP 0.01uF +10/-10% X7R
C36 = CAP: RoHS CHIP CAP 0.1uF +10/-10% X7R
ED16 ED18 = DIODE BI_DIR TRIG_0: as ED2 on sheet 04; Part Type: ESD_TVS; Manufacturer PN: ESD5451N; Created by: JJJ
ED17 ED19 = DIODE BI_DIR TRIG_0: as ED1 on sheet 04; Created by: JJJ; Part Type: ESD_TVS; RK PN: ESD5451N
J8 = PHONEJACK STEREO SW_0: 耳插; BOM_VALUE: 0; BOM_TYPE: 60
J9 J10 = CON2
R30 R35 = RESISTOR_0: as R1 on sheet 05; Part Type: 通用厚膜电阻; Manufacturer PN: RC0402JR-070RL; Created by: YTL
R31 = RESISTOR_0: as R2 on sheet 05; Created by: YTL; Part Type: 通用厚膜电阻; RK PN: RC0402JR-070RL
R32 R33 = RESISTOR: ROHS CHIP RES 0R 1/16W 5%
R34 = RESISTOR: ROHS CHIP RES 2K2 1/16W 5%
TP1 TP3 TP5 = TP: Test Point 0.7mm; RK PN: TESTPOINT_0R7; Priority: A; Part Type: TP; Created by: JJJ
TP2 TP4 = TP: Test Point 0.7mm; Priority: A; RK PN: TESTPOINT_0R7; Created by: JJJ; Part Type: TP
*#7 = radxa_1010: Page Create Date: March  8, 1995

## Sheet 09.SchDoc
size 297 x 209 mm
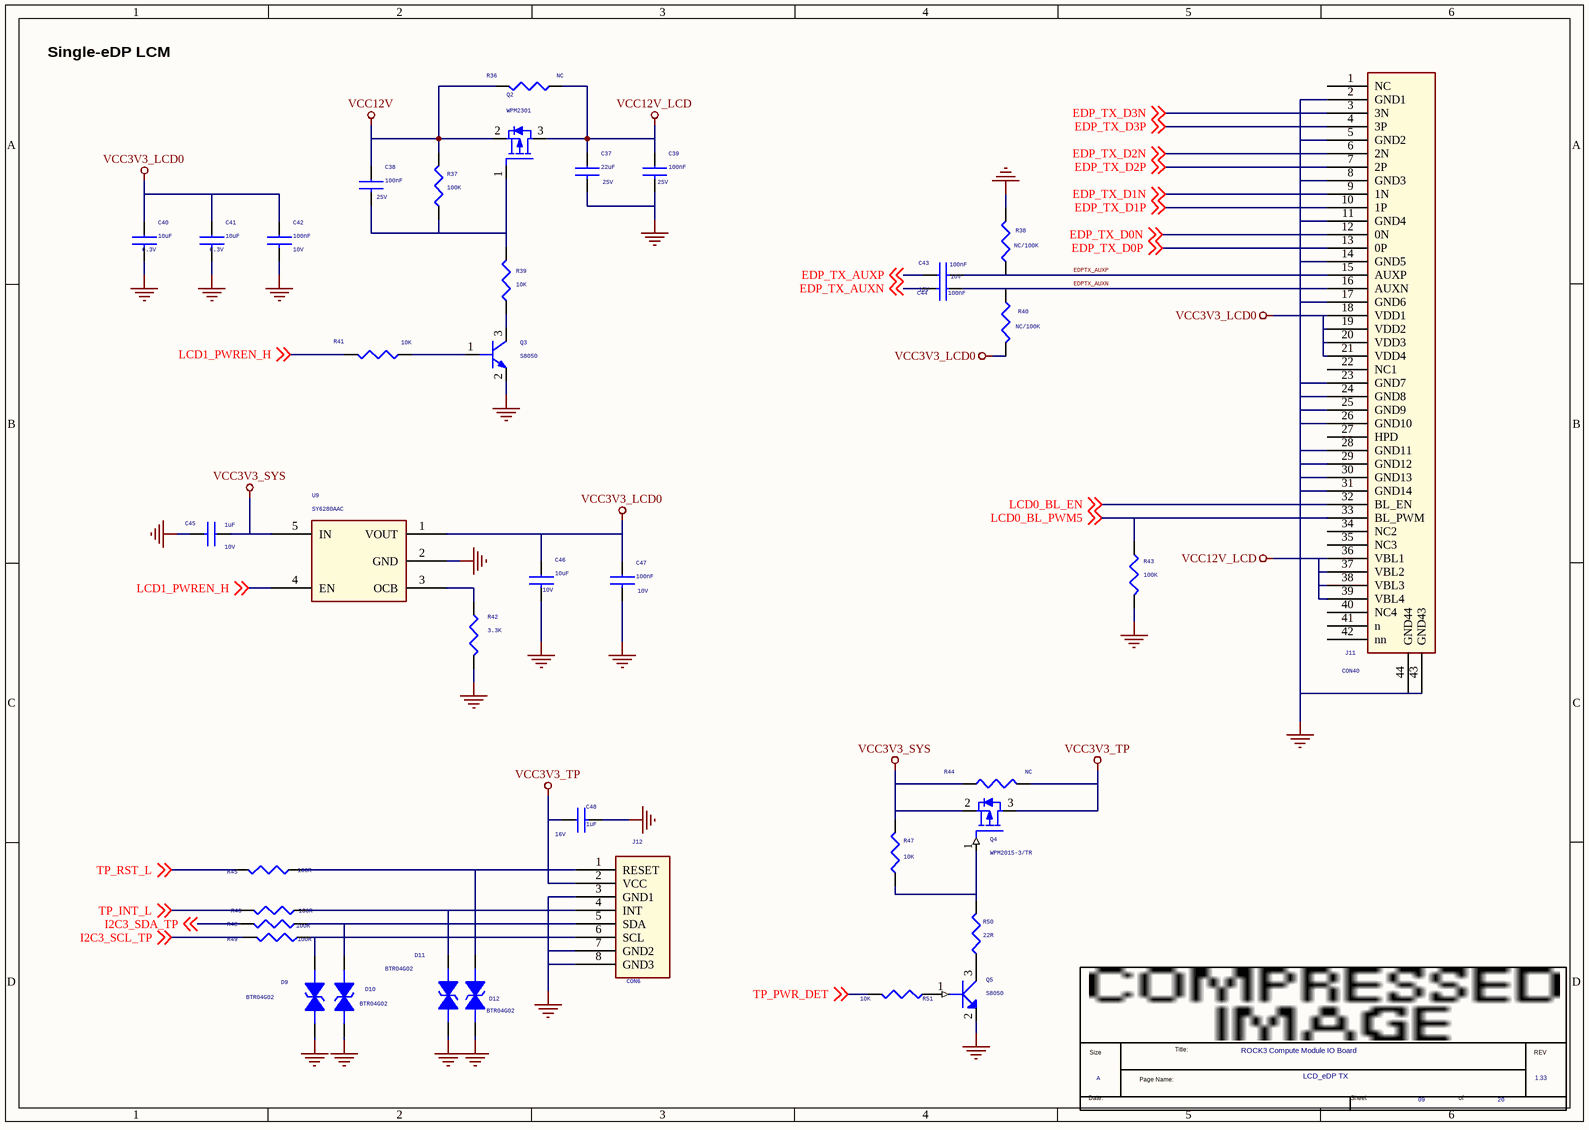
[diagram p7: 09.SchDoc]

### Parts
(Parts that share a designator on the sheet are numbered #1, #2 ... from top to bottom, then left to right.)
*#8  Page Count: 20  Page Number: 09  Page Size: A  Title: ROCK3 Compute Module IO Board  RevCode: 1.33  Doc: LCD_eDP TX  (hidden comment: radxa_1010)  (graphical)
C37  22uF  Voltage: 25V  [C0805]
C38  100nF  Voltage: 25V  [C0402]
C39  100nF  Voltage: 25V  [C0402]
C40  10uF  Voltage: 6.3V  [C0603]
C41  10uF  Voltage: 6.3V  [C0603]
C42  100nF  Voltage: 10V  [C0402]
C43  100nF  Voltage: 10V  [C0402]
C44  100nF  Voltage: 10V  [C0402]
C45  1uF  Voltage: 10V  [C0402]
C46  10uF  Voltage: 10V  [C0603]
C47  100nF  Voltage: 10V  [C0402]
C48  1uF  Voltage: 16V  [C0402]
D9  BTR04G02  [ESD0402_1xD5]
D10  BTR04G02  [ESD0402_1xD5]
D11  BTR04G02  [ESD0402_1xD5]
D12  BTR04G02  [ESD0402_1xD5]
J11  CON40  [20455-040E-TOP]
J12  CON6  [FPC6-0.5MM-2660H]
Q2  WPM2301  [SOT23]
Q3  S8050  [SOT23]
Q4  WPM2015-3/TR  [SOT23]
Q5  S8050  [SOT23]
R36  NC  [R0402]
R37  100K  [R0402]
R38  NC/100K  [R0402]
R39  10K  [R0402]
R40  NC/100K  [R0402]
R41  10K  [R0402]
R42  3.3K  [R0402]
R43  100K  [R0402]
R44  NC  [R0402]
R45  100R  [R0402]
R46  100R  [R0402]
R47  10K  [R0402]
R48  100R  [R0402]
R49  100R  [R0402]
R50  22R  [R0402]
R51  10K  [R0402]
U9  SY6280AAC  [SOT_23_5]

### Nets
GND: C37.2 C39.2 C40.2 C41.2 C42.2 C45.2 C46.2 C47.2 C48.2 D9.1 D10.1 D11.1 D12.1 J11.2(GND1) J11.5(GND2) J11.8(GND3) J11.11(GND4) J11.14(GND5) J11.17(GND6) J11.23(GND7) J11.24(GND8) J11.25(GND9) J11.26(GND10) J11.28(GND11) J11.29(GND12) J11.30(GND13) J11.31(GND14) J11.43(GND43) J11.44(GND44) J12.3(GND1) J12.7(GND2) J12.8(GND3) Q3.2(EMITTER) Q5.2(E) R38.1 R42.2 R43.2 U9.2(GND)
VCC3V3_LCD0: C40.1 C41.1 C42.1 C46.1 C47.1 J11.18(VDD1) J11.19(VDD2) J11.20(VDD3) J11.21(VDD4) R40.2 U9.1(VOUT)
VCC3V3_SYS: C45.1 Q4.2(SOURCE) R44.1 R47.2 U9.5(IN)
VCC3V3_TP: C48.1 J12.2(VCC) Q4.3(DRAIN) R44.2
VCC12V: C38.1 Q2.2(SOURCE) R36.1 R37.1
VCC12V_LCD: C37.1 C39.1 J11.36(VBL1) J11.37(VBL2) J11.38(VBL3) J11.39(VBL4) Q2.3(DRAIN) R36.2
EDP_TX_AUXN: C44.2 ; off-sheet EDP_TX_AUXN
EDP_TX_AUXP: C43.1 ; off-sheet EDP_TX_AUXP
EDP_TX_D0N: J11.12(0N) ; off-sheet EDP_TX_D0N
EDP_TX_D0P: J11.13(0P) ; off-sheet EDP_TX_D0P
EDP_TX_D1N: J11.9(1N) ; off-sheet EDP_TX_D1N
EDP_TX_D1P: J11.10(1P) ; off-sheet EDP_TX_D1P
EDP_TX_D2N: J11.6(2N) ; off-sheet EDP_TX_D2N
EDP_TX_D2P: J11.7(2P) ; off-sheet EDP_TX_D2P
EDP_TX_D3N: J11.3(3N) ; off-sheet EDP_TX_D3N
EDP_TX_D3P: J11.4(3P) ; off-sheet EDP_TX_D3P
EDPTX_AUXN: C44.1 J11.16(AUXN) R40.1
EDPTX_AUXP: C43.2 J11.15(AUXP) R38.2
I2C3_SCL_TP: R49.1 ; off-sheet I2C3_SCL_TP
I2C3_SDA_TP: R48.1 ; off-sheet I2C3_SDA_TP
LCD0_BL_EN: J11.32(BL_EN) ; off-sheet LCD0_BL_EN
LCD0_BL_PWM5: J11.33(BL_PWM) R43.1 ; off-sheet LCD0_BL_PWM5
LCD1_PWREN_H: R41.1 U9.4(EN) ; off-sheet LCD1_PWREN_H
TP_INT_L: R46.1 ; off-sheet TP_INT_L
TP_PWR_DET: R51.2 ; off-sheet TP_PWR_DET
TP_RST_L: R45.1 ; off-sheet TP_RST_L
NetC38_2: C38.2 Q2.1(GATE) R37.2 R39.1
NetD9_2: D9.2 J12.6(SCL) R49.2
NetD10_2: D10.2 J12.5(SDA) R48.2
NetD11_2: D11.2 J12.4(INT) R46.2
NetD12_2: D12.2 J12.1(RESET) R45.2
NetQ3_1: Q3.1(BASE) R41.2
NetQ3_3: Q3.3(COLLECTOR) R39.2
NetQ4_1: Q4.1(GATE) R47.1 R50.2
NetQ5_1: Q5.1(B) R51.1
NetQ5_3: Q5.3(C) R50.1
NetR42_1: R42.1 U9.3(OCB)

Not connected (* = marked no-connect by the designer): J11 1(NC) 22(NC1) 27(HPD) 34(NC2) 35(NC3) 40(NC4) 41(n) 42(nn)

### Notes on the sheet
- Single-eDP LCM
- (in symbol radxa_1010) Title:; Size; REV; Page Name:; Date:; Sheet; of

### Library data of the parts
C37 = CAP NP_0: as C7 on sheet 06; Dielectric: X5R; Created by: JJJ; Part Type: C0603; RK PN: C1608X5R0J106K080AB
C38 = CAP NP_0: as C6 on sheet 06; Dielectric: X5R; Part Type: C0402; Manufacturer PN: C1005X5R1C104K050BA; Created by: JJJ
C39 = CAP NP_0: as C3 on sheet 05; Dielectric: X5R; Created by: JJJ; Part Type: C0402; RK PN: C1005X5R1C104K050BA
C40 C41 = CAP NP_0: cap,10.00uF,+/-10%,6.3V,X5R,C0603; Manufacturer: TDK; RK PN: C1608X5R0J106K080AB; Priority: A; Tolerance: 10%; Dielectric: X5R; Part Type: C0603; C_Voltage: 6.3V; Manufacturer PN: C1608X5R0J106K080AB; Created by: JJJ
C42-C44 = CAP NP_0: cap,100.00nF,+/-10%,10V,X5R,C0402; Manufacturer PN: C1005X5R1A104K050BA; Manufacturer: TDK; Tolerance: 10%; Priority: A; Dielectric: X5R; Created by: JJJ; Part Type: C0402; RK PN: C1005X5R1A104K050BA
C45 = CAP NP_0: cap,1.00uF,+/-10%,10V,X5R,C0402; Manufacturer PN: C1005X5R1A105K050BB; Manufacturer: TDK; Tolerance: 10%; C_Voltage: 6.3V; Priority: A; Dielectric: X5R; Created by: JJJ; Part Type: C0402; RK PN: C1005X5R1A105K050BB
C46 = CAP NP_0: cap,10.00uF,+/-10%,10V,X5R,C0603; Manufacturer: TDK; RK PN: C1608X5R1A106K080AC; Priority: A; Tolerance: 10%; Dielectric: X5R; Part Type: C0603; Manufacturer PN: C1608X5R1A106K080AC; Created by: JJJ
C47 = CAP NP_0: cap,100.00nF,+/-10%,10V,X5R,C0402; Manufacturer: TDK; RK PN: C1005X5R1A104K050BA; Priority: A; Tolerance: 10%; Dielectric: X5R; Part Type: C0402; Manufacturer PN: C1005X5R1A104K050BA; Created by: JJJ
C48 = CAP NP_0: cap,100.00nF,+/-10%,6.3V,X5R,C0402; Manufacturer: TDK; RK PN: C1005X5R0J104K050BA; Priority: A; Tolerance: 10%; Dielectric: X5R; Part Type: C0402; Manufacturer PN: C1005X5R0J104K050BA; Created by: JJJ
D9 = DIODE BI_DIR TRIG_0: as D3 on sheet 05; Created by: JJJ; Part Type: ESD_TVS; RK PN: ESD5451N
D10-D12 = DIODE BI_DIR TRIG_0: as D4 on sheet 05; Part Type: ESD_TVS; Manufacturer PN: ESD5451N; Created by: JJJ
J11 = CON40_1
J12 = CON6_1
Q2 = MOSFET P_Dup1: as Q1 on sheet 06; RK PN: WPM3407-3/TR; Part Type: PMOS; Manufacturer PN: WPM3407-3/TR; Created by: JJJ
Q3 = NPN: S8050,SOT23; Manufacturer: 长电; Manufacturer PN: S8050_SOT23; Priority: A; Ic: 0.5A; Vceo: 25V; Pc: 0.3W; RK PN: S8050; Part Type: NPN; Created by: JJJ
Q4 = MOSFET P: PMOS,WPM2015-3/TR,SOT_23,Id=2.4A,Vds=20V; Manufacturer: WillSemi(韦尔半导体); ROOM: CHG; Priority: A; Id_max: 2.4A; Vgs: ±8V; VDS: 20V; Vgsth: 0.62V; Pd: 0.5W; option: DNP; RK PN: WPM2015-3/TR; Part Type: PMOS; Manufacturer PN: WPM2015-3/TR; Created by: JJJ
Q5 = NPN4
R36 R41 = RESISTOR_0: as R23 on sheet 07; Part Type: 通用厚膜电阻; Manufacturer PN: RC0402JR-0710KL; Created by: YTL
R37 R43 R45 R49 = RESISTOR_0: as R12 on sheet 06; Part Type: 通用厚膜电阻; Manufacturer PN: RC0402JR-07100KL; Created by: YTL
R38 = RESISTOR_0: 通用厚膜电阻,100K,+/-5%,R0402,1/16W.; Manufacturer PN: RC0402JR-07100KL; Manufacturer: YAGEO; Tolerance: 5%; Option: DNP; Wattage: 1/16W; Priority: A; Created by: YTL; Part Type: 通用厚膜电阻; RK PN: RC0402JR-07100KL
R39 R47 = RESISTOR_0: as R13 on sheet 06; Created by: YTL; Part Type: 通用厚膜电阻; RK PN: RC0402JR-0710KL
R40 = RESISTOR_0: 通用厚膜电阻,100K,+/-5%,R0402,1/16W.; Manufacturer: YAGEO; Tolerance: 5%; Option: DNP; RK PN: RC0402JR-07100KL; Priority: A; Wattage: 1/16W; Part Type: 通用厚膜电阻; Manufacturer PN: RC0402JR-07100KL; Created by: YTL
R42 = RESISTOR_0: 通用厚膜电阻,4K7,+/-5%,R0402,1/16W.; Manufacturer PN: RC0402JR-074K7L; Manufacturer: YAGEO; Tolerance: 5%; Wattage: 1/16W; Priority: A; Created by: YTL; Part Type: 通用厚膜电阻; RK PN: RC0402JR-074K7L
R44 = RESISTOR_0: as R1 on sheet 05; Part Type: 通用厚膜电阻; Manufacturer PN: RC0402JR-070RL; Created by: YTL
R46 R48 R51 = RESISTOR_0: as R14 on sheet 07; Created by: YTL; Part Type: 通用厚膜电阻; RK PN: RC0402JR-07100KL
R50 = RESISTOR_0_Dup1
U9 = SWITCH_SY6280: Low Loss Power Distribution Switch; Manufacturer: Silergy（矽力杰）; Priority: A; Created by: JJJ; Manufacturer PN: SY6280AAC; Part Type: Switch; RK PN: SY6280AAC
*#8 = radxa_1010: Page Create Date: March  8, 1995

## Sheet 10.SchDoc
size 297 x 209 mm
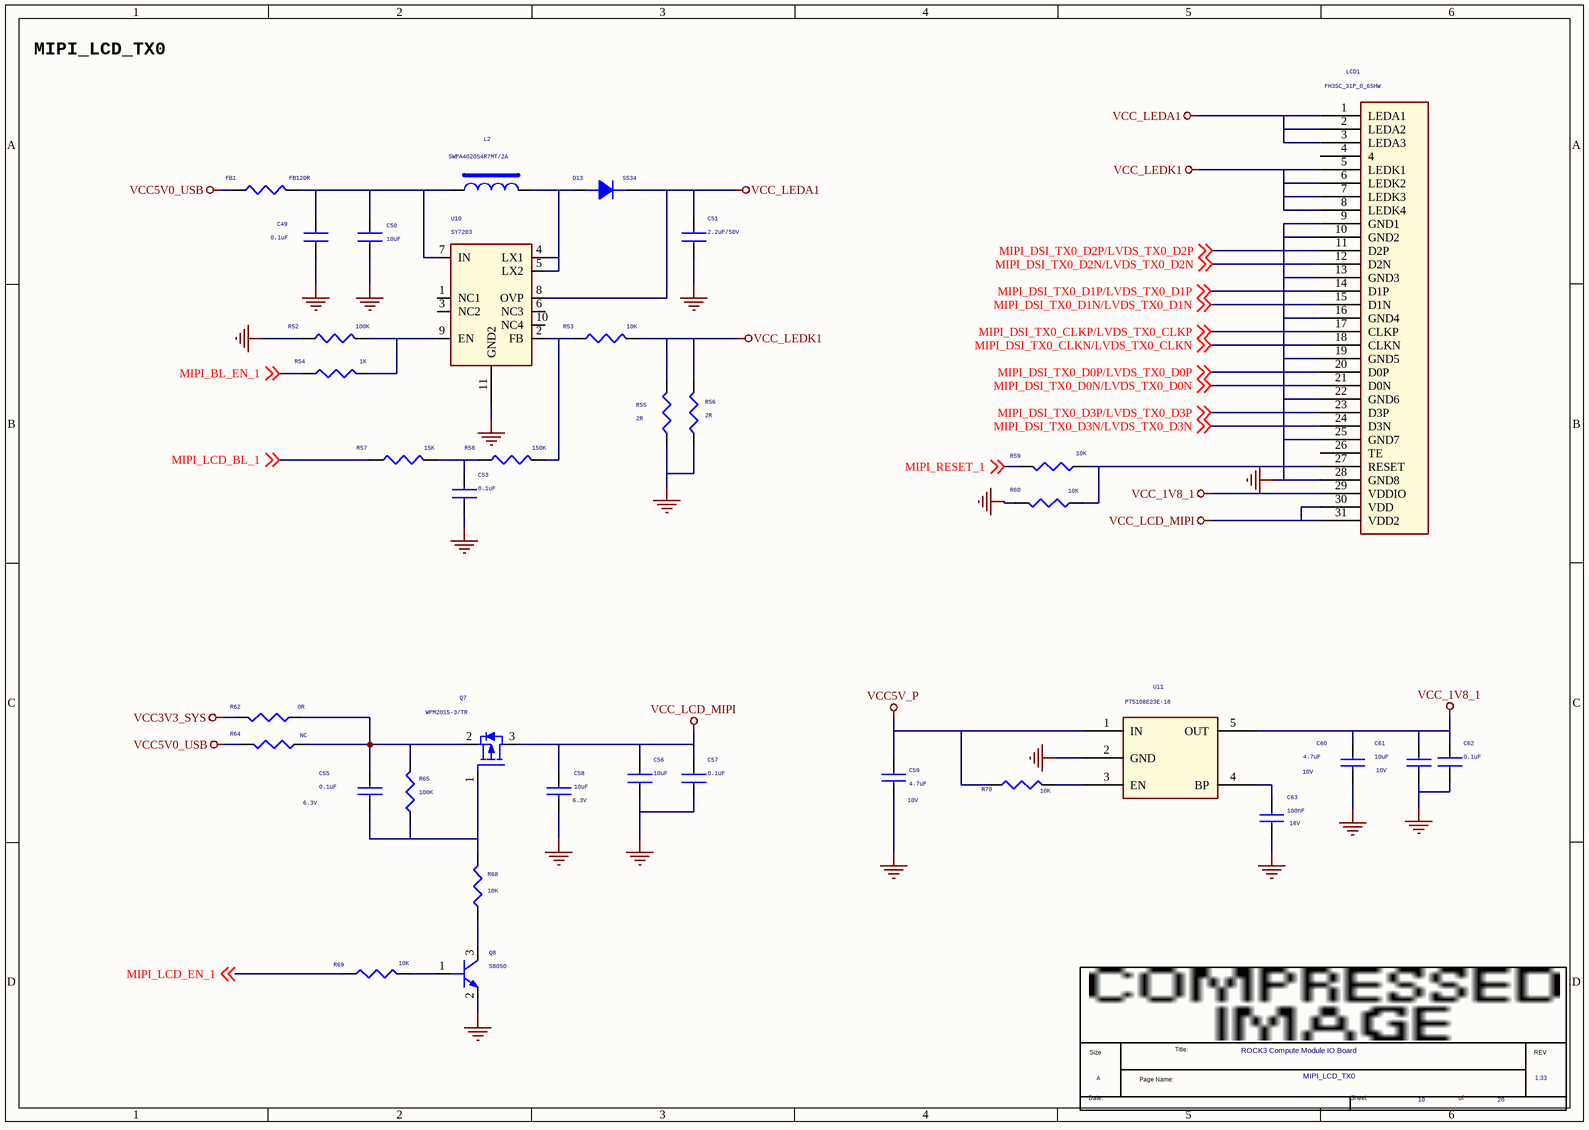
[diagram p8: 10.SchDoc]

### Parts
(Parts that share a designator on the sheet are numbered #1, #2 ... from top to bottom, then left to right.)
*#9  Page Count: 20  Page Number: 10  Page Size: A  Title: ROCK3 Compute Module IO Board  RevCode: 1.33  Doc: MIPI_LCD_TX0  (hidden comment: radxa_1010)  (graphical)
C49  0.1uF  [C0603]
C50  10uF  [C0603]
C51  2.2uF/50V  [C0603]
C53  0.1uF  [C0603]
C55  0.1uF  Voltage: 6.3V  [C0402]
C56  10uF  [C0603]
C57  0.1uF  [C0603]
C58  10uF  Voltage: 6.3V  [C0603]
C59  4.7uF  Voltage: 10V  [C0603]
C60  4.7uF  Voltage: 10V  [C0603]
C61  10uF  Voltage: 10V  [C0603]
C62  0.1uF  [C0603]
C63  100nF  Voltage: 16V  [C0402]
D13  SS34  [DO214AC]
FB1  FB120R  [R0603]
L2  SWPA4020S4R7MT/2A  [IND-4X4]
LCD1  FH35C_31P_0_6SHW  [HQ101WX001]
Q7  WPM2015-3/TR  [SOT23]
Q8  S8050  [SOT23]
R52  100K  [R0402]
R53  10K  [R0402]
R54  1K  [R0402]
R55  2R  [R0805]
R56  2R  [R0805]
R57  15K  [R0402]
R58  150K  [R0402]
R59  10K  [R0402]
R60  10K  [R0402]
R62  0R  [R0603]
R64  NC  [R0603]
R65  100K  [R0402]
R68  10K  [R0402]
R69  10K  [R0402]
R70  10K  [R0402]
U10  SY7203  [QFN8-2X2]
U11  PT5108E23E-18  [SOT25]

### Nets
GND: C49.2 C50.2 C51.2 C53.1 C56.2 C57.2 C58.2 C59.2 C60.2 C61.2 C62.2 C63.2 LCD1.9(GND1) LCD1.10(GND2) LCD1.13(GND3) LCD1.16(GND4) LCD1.19(GND5) LCD1.22(GND6) LCD1.25(GND7) LCD1.28(GND8) Q8.2(EMITTER) R52.1 R55.2 R56.2 R60.2 U10.11(GND2) U11.2(GND)
VCC3V3_SYS: R62.1
VCC5V0_USB: FB1.1 R64.1
VCC5V_P: C59.1 R70.1 U11.1(IN)
VCC_1V8_1: C60.1 C61.1 C62.1 LCD1.29(VDDIO) U11.5(OUT)
VCC_LCD_MIPI: C56.1 C57.1 C58.1 LCD1.30(VDD) LCD1.31(VDD2) Q7.3(DRAIN)
VCC_LEDA1: C51.1 D13.2(K) LCD1.1(LEDA1) LCD1.2(LEDA2) LCD1.3(LEDA3) U10.8(OVP)
VCC_LEDK1: LCD1.5(LEDK1) LCD1.6(LEDK2) LCD1.7(LEDK3) LCD1.8(LEDK4) R53.2 R55.1 R56.1
MIPI_BL_EN_1: R54.1 ; off-sheet MIPI_BL_EN_1
MIPI_DSI_TX0_CLKN/LVDS_TX0_CLKN: LCD1.18(CLKN) ; off-sheet MIPI_DSI_TX0_CLKN/LVDS_TX0_CLKN
MIPI_DSI_TX0_CLKP/LVDS_TX0_CLKP: LCD1.17(CLKP) ; off-sheet MIPI_DSI_TX0_CLKP/LVDS_TX0_CLKP
MIPI_DSI_TX0_D0N/LVDS_TX0_D0N: LCD1.21(D0N) ; off-sheet MIPI_DSI_TX0_D0N/LVDS_TX0_D0N
MIPI_DSI_TX0_D0P/LVDS_TX0_D0P: LCD1.20(D0P) ; off-sheet MIPI_DSI_TX0_D0P/LVDS_TX0_D0P
MIPI_DSI_TX0_D1N/LVDS_TX0_D1N: LCD1.15(D1N) ; off-sheet MIPI_DSI_TX0_D1N/LVDS_TX0_D1N
MIPI_DSI_TX0_D1P/LVDS_TX0_D1P: LCD1.14(D1P) ; off-sheet MIPI_DSI_TX0_D1P/LVDS_TX0_D1P
MIPI_DSI_TX0_D2N/LVDS_TX0_D2N: LCD1.12(D2N) ; off-sheet MIPI_DSI_TX0_D2N/LVDS_TX0_D2N
MIPI_DSI_TX0_D2P/LVDS_TX0_D2P: LCD1.11(D2P) ; off-sheet MIPI_DSI_TX0_D2P/LVDS_TX0_D2P
MIPI_DSI_TX0_D3N/LVDS_TX0_D3N: LCD1.24(D3N) ; off-sheet MIPI_DSI_TX0_D3N/LVDS_TX0_D3N
MIPI_DSI_TX0_D3P/LVDS_TX0_D3P: LCD1.23(D3P) ; off-sheet MIPI_DSI_TX0_D3P/LVDS_TX0_D3P
MIPI_LCD_BL_1: R57.1 ; off-sheet MIPI_LCD_BL_1
MIPI_LCD_EN_1: R69.1 ; off-sheet MIPI_LCD_EN_1
MIPI_RESET_1: R59.2 ; off-sheet MIPI_RESET_1
NetC49_1: C49.1 C50.1 FB1.2 L2.1 U10.7(IN)
NetC53_2: C53.2 R57.2 R58.1
NetC55_1: C55.1 Q7.2(SOURCE) R62.2 R64.2 R65.1
NetC55_2: C55.2 Q7.1(GATE) R65.2 R68.1
NetC63_1: C63.1 U11.4(BP)
NetD13_1: D13.1(A) L2.2 U10.4(LX1) U10.5(LX2)
NetLCD1_27: LCD1.27(RESET) R59.1 R60.1
NetQ8_1: Q8.1(BASE) R69.2
NetQ8_3: Q8.3(COLLECTOR) R68.2
NetR52_2: R52.2 R54.2 U10.9(EN)
NetR53_1: R53.1 R58.2 U10.2(FB)
NetR70_2: R70.2 U11.3(EN)

Not connected (* = marked no-connect by the designer): LCD1 4 26(TE); U10 1(NC1) 3(NC2) 6(NC3) 10(NC4)

### Notes on the sheet
- MIPI_LCD_TX0
- (in symbol radxa_1010) Title:; Size; REV; Page Name:; Date:; Sheet; of

### Library data of the parts
C49 C57 C62 = CAP NP: CAP,MLCC,100nF,+/-10%,X7R,6.3V,SMD0402
C50 = CAP NP
C51 = CAP NP: RoHS CHIP CAP 1uF +10/-10% 25V X5R
C53 = CAP NP: RoHS CHIP CAP 0.1uF +10/-10% X7R
C55 = CAP NP_0: cap,100.00nF,+/-10%,6.3V,X5R,C0402; Manufacturer PN: C1005X5R0J104K050BA; Manufacturer: TDK; Tolerance: 10%; Priority: A; Dielectric: X5R; Created by: JJJ; Part Type: C0402; RK PN: C1005X5R0J104K050BA
C56 = CAP NP: CAP,MLCC,4.7uF,+/-10%,X5R,6.3V,SMD0603
C58 = CAP NP_0: cap,4.70uF,+/-10%,6.3V,X5R,C0603; Manufacturer PN: C1608X5R0J475K080AB; Manufacturer: TDK; Tolerance: 10%; Priority: A; Dielectric: X5R; Created by: JJJ; Part Type: C0603; RK PN: C1608X5R0J475K080AB
C59 C60 = CAP NP_0: cap,4.70uF,+/-10%,10V,X5R,C0603; Manufacturer PN: C1608X5R1A475K080AC; Manufacturer: TDK; Tolerance: 10%; Priority: A; Dielectric: X5R; Created by: JJJ; Part Type: C0603; RK PN: C1608X5R1A475K080AC
C61 = CAP NP_0: cap,10.00uF,+/-10%,10V,X5R,C0805; Manufacturer PN: C2012X5R1A106K125AB; Manufacturer: TDK; Tolerance: 10%; Priority: A; Dielectric: X5R; Created by: JJJ; Part Type: C0805; RK PN: C2012X5R1A106K125AB
C63 = CAP NP_0: as C6 on sheet 06; Dielectric: X5R; Part Type: C0402; Manufacturer PN: C1005X5R1C104K050BA; Created by: JJJ
D13 = DIODE
FB1 R52 R57-R60 = RES 1B: ROHS CHIP RES 4.7K 1/16W 5%
L2 = INDUCTORS OF FERRITE
LCD1 = HQ101WX001
Q7 = MOSFET P_Dup1: PMOS,WPM2015-3/TR,SOT23,Id=2.4A,Vds=20V; Manufacturer: WillSemi(韦尔半导体); Pd: 0.5W; Vgsth: 0.62V; VDS: 20V; Vgs: ±8V; Id: 2.4A; Priority: A; Created by: JJJ; Manufacturer PN: WPM2015-3/TR; Part Type: PMOS; RK PN: WPM2015-3/TR
Q8 = NPN: S8050 SOT23; Manufacturer: 长电; Manufacturer PN: S8050_SOT23; Priority: A; Ic: 0.5A; Vceo: 25V; Pc: 0.3W; RK PN: S8050; Part Type: NPN; Created by: JJJ
R53 = RES 1B: ROHS CHIP RES 82K 1/16W 5%
R54 R70 = RESISTOR_0: as R23 on sheet 07; Part Type: 通用厚膜电阻; Manufacturer PN: RC0402JR-0710KL; Created by: YTL
R55 R56 R62 R64 = RES 1B: ROHS CHIP RES 4.7R 1/4W 5%
R65 = RESISTOR_0: as R14 on sheet 07; Created by: YTL; Part Type: 通用厚膜电阻; RK PN: RC0402JR-07100KL
R68 R69 = RESISTOR_0: as R13 on sheet 06; Created by: YTL; Part Type: 通用厚膜电阻; RK PN: RC0402JR-0710KL
U10 = MP3202-QFN8_1
U11 = LDO_PT5108: 500mA, Low Dropout, Low Noise Ultra-Fast Without Bypass Capacitor CMOS LDO Regulator; Manufacturer: Richtek（立錡）; Manufacturer PN: RT9013-30GB; Option: /CE75B30M; RK PN: RT9013-30B; Priority: A; Part Type: LDO; Created by: JJJ
*#9 = radxa_1010: Page Create Date: March  8, 1995

## Sheet 11.SchDoc
size 420 x 297 mm
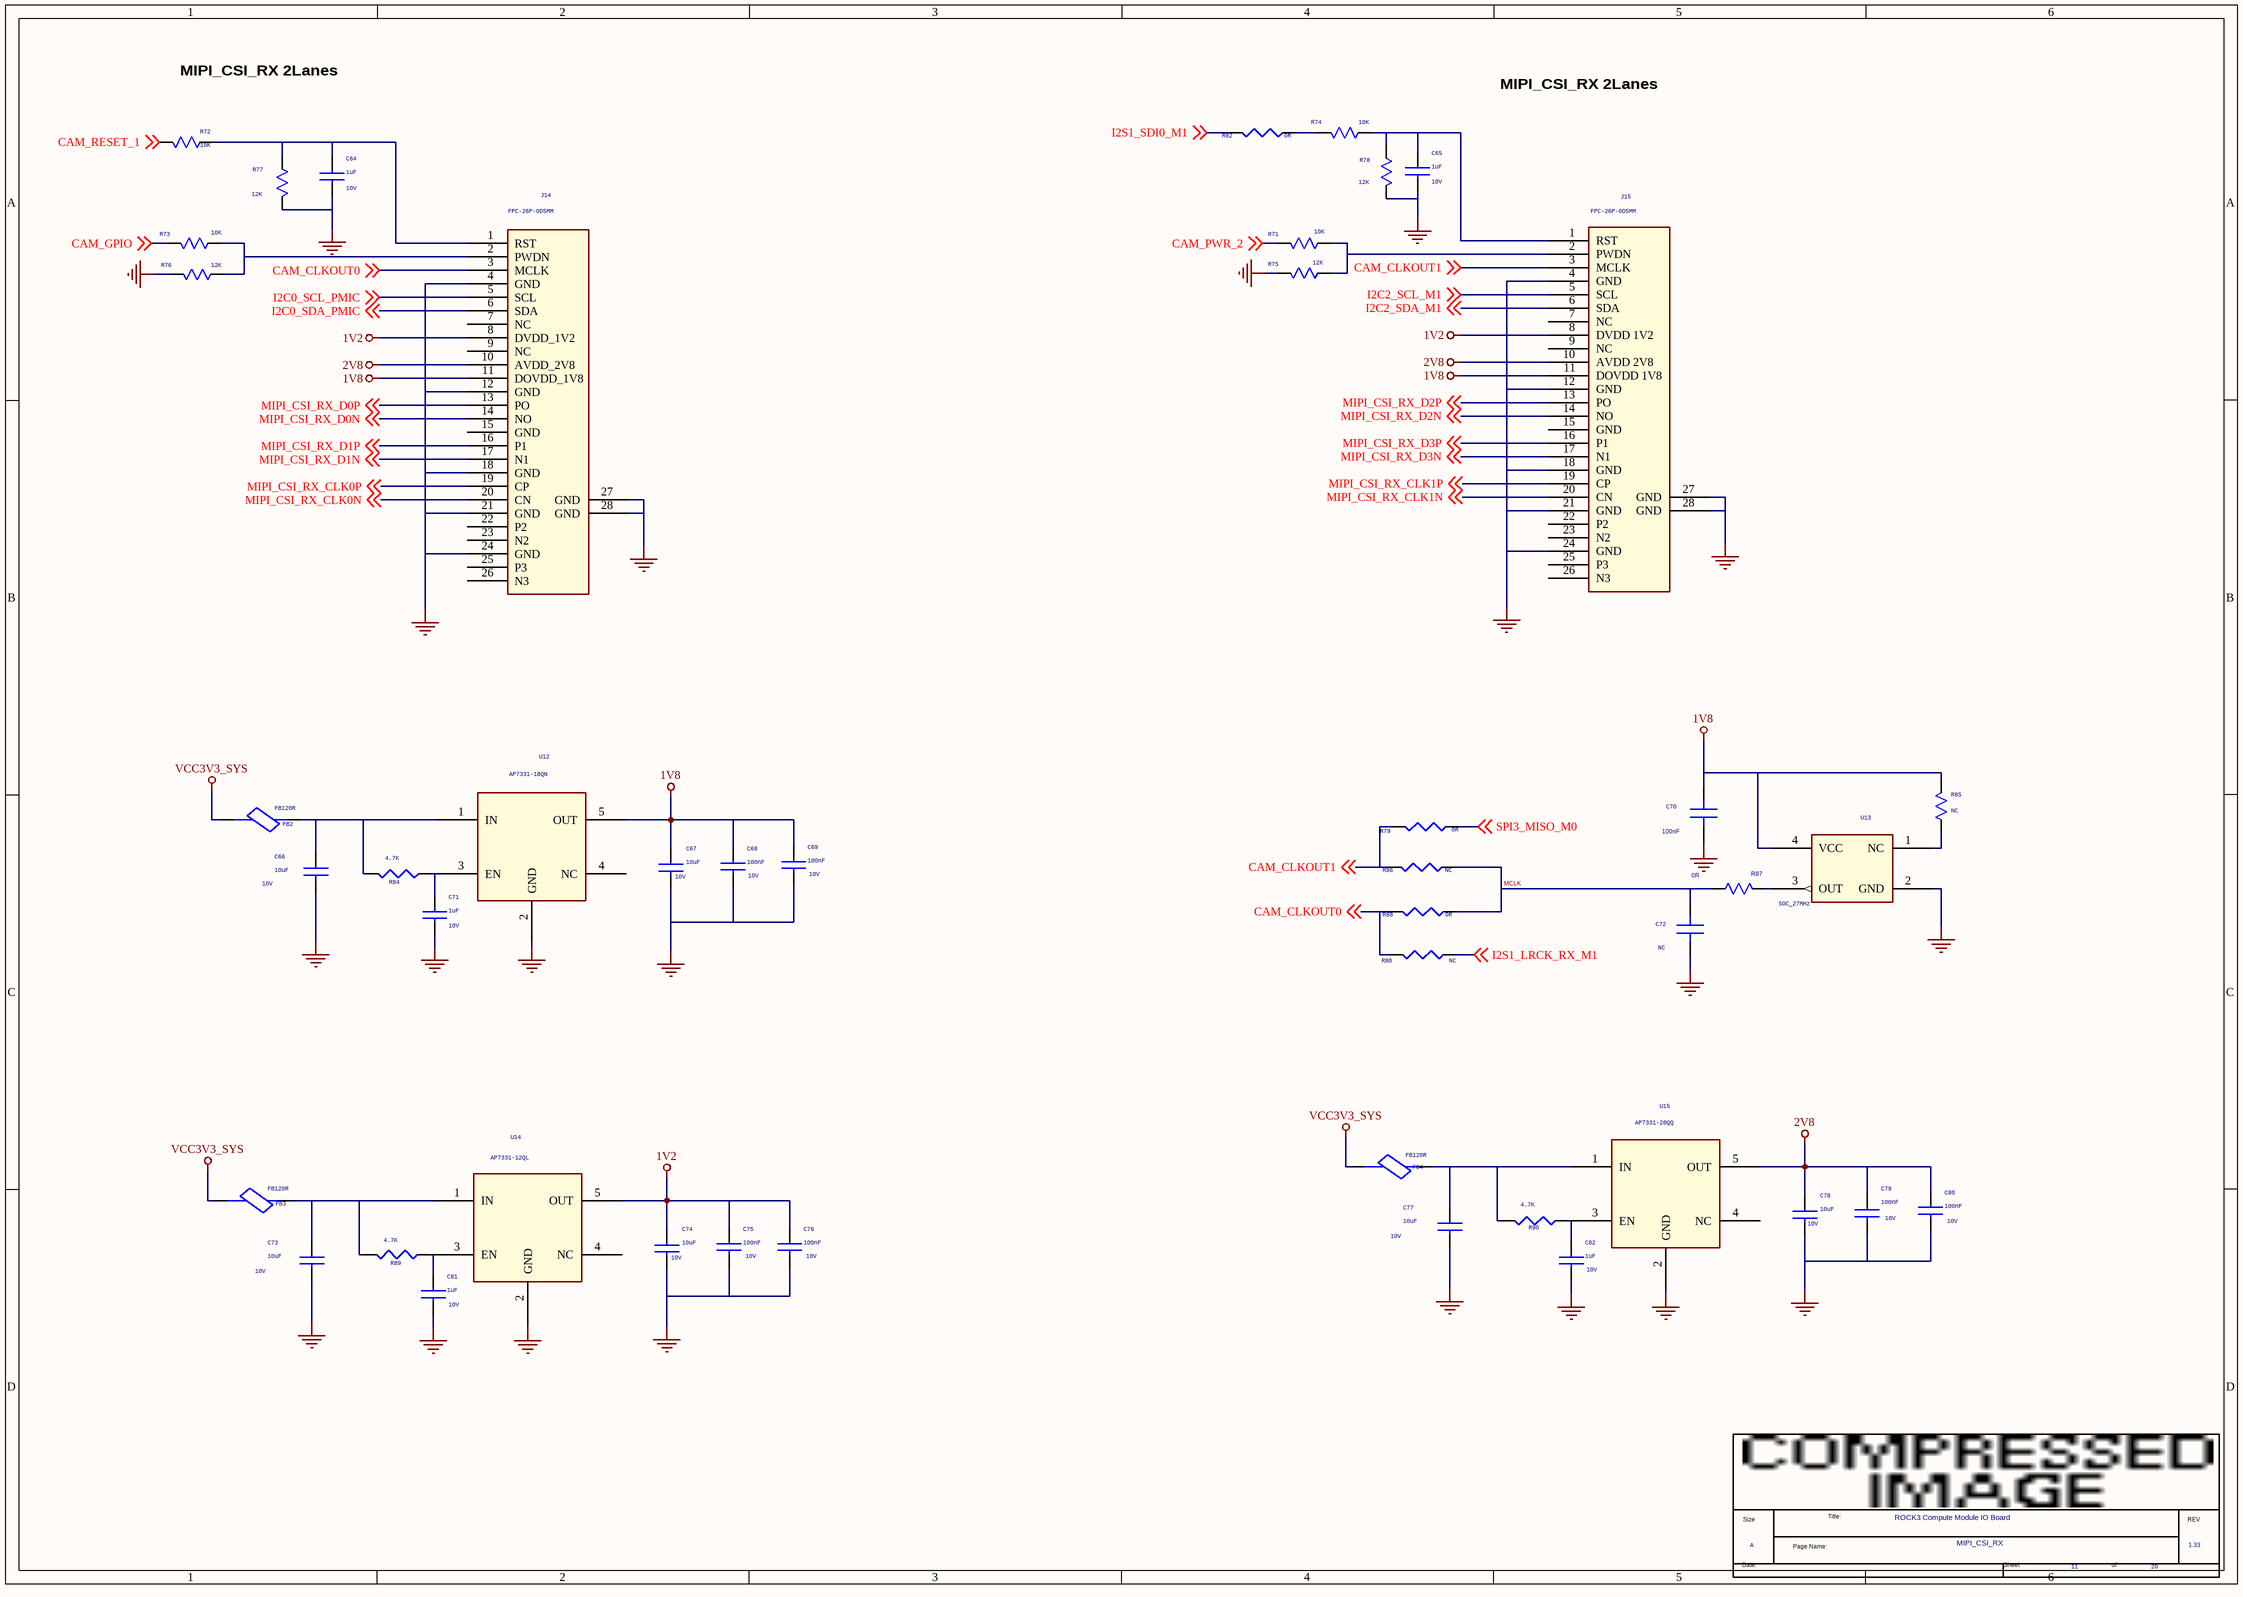
[diagram p9: 11.SchDoc]

### Parts
(Parts that share a designator on the sheet are numbered #1, #2 ... from top to bottom, then left to right.)
*#10  Page Count: 20  Page Number: 11  Page Size: A  Title: ROCK3 Compute Module IO Board  RevCode: 1.33  Doc: MIPI_CSI_RX  (hidden comment: radxa_1010)  (graphical)
C64  1uF  Voltage: 10V  [C0402]
C65  1uF  Voltage: 10V  [C0402]
C66  10uF  Voltage: 10V  [C0603]
C67  10uF  Voltage: 10V  [C0603]
C68  100nF  Voltage: 10V  [C0402]
C69  100nF  Voltage: 10V  [C0402]
C70  100nF  [C0402]
C71  1uF  Voltage: 10V  [C0402]
C72  NC  [C0402]
C73  10uF  Voltage: 10V  [C0603]
C74  10uF  Voltage: 10V  [C0603]
C75  100nF  Voltage: 10V  [C0402]
C76  100nF  Voltage: 10V  [C0402]
C77  10uF  Voltage: 10V  [C0603]
C78  10uF  Voltage: 10V  [C0603]
C79  100nF  Voltage: 10V  [C0402]
C80  100nF  Voltage: 10V  [C0402]
C81  1uF  Voltage: 10V  [C0402]
C82  1uF  Voltage: 10V  [C0402]
FB2  FB120R  [R0402]
FB3  FB120R  [R0402]
FB4  FB120R  [R0402]
J14  FPC-26P-0D5MM  [com40pin_0_5]
J15  FPC-26P-0D5MM  [com40pin_0_5]
R71  10K  [R0402]
R72  10K  [R0402]
R73  10K  [R0402]
R74  10K  [R0402]
R75  12K  [R0402]
R76  12K  [R0402]
R77  12K  [R0402]
R78  12K  [R0402]
R79  0R  [R0402]
R80  NC  [R0402]
R82  0R  [R0402]
R84  4.7K  [R0402]
R85  NC  [R0402]
R86  NC  [R0402]
R87  0R  [R0402]
R88  0R  [R0402]
R89  4.7K  [R0402]
R90  4.7K  [R0402]
U12  AP7331-18QN  [SOT25]
U13  SOC_27MHz  [CRY4_3R20X2R50X0R80]
U14  AP7331-12QL  [SOT25]
U15  AP7331-28QQ  [SOT25]

### Nets
1V2: C74.1 C75.1 C76.1 J14.8(DVDD_1V2) J15.8(DVDD_1V2) U14.5(OUT)
1V8: C67.1 C68.1 C69.1 C70.1 J14.11(DOVDD_1V8) J15.11(DOVDD_1V8) R85.2 U12.5(OUT) U13.4(VCC)
2V8: C78.1 C79.1 C80.1 J14.10(AVDD_2V8) J15.10(AVDD_2V8) U15.5(OUT)
GND: C64.2 C65.2 C66.2 C67.2 C68.2 C69.2 C70.2 C71.2 C72.2 C73.2 C74.2 C75.2 C76.2 C77.2 C78.2 C79.2 C80.2 C81.2 C82.2 J14.4(GND) J14.12(GND) J14.18(GND) J14.21(GND) J14.24(GND) J14.27(GND) J14.28(GND) J15.4(GND) J15.12(GND) J15.18(GND) J15.21(GND) J15.24(GND) J15.27(GND) J15.28(GND) R75.2 R76.2 R77.1 R78.1 U12.2(GND) U13.2(GND) U14.2(GND) U15.2(GND)
VCC3V3_SYS: FB2.1 FB3.1 FB4.1
CAM_CLKOUT0: J14.3(MCLK) R80.1 R88.2 ; off-sheet CAM_CLKOUT0
CAM_CLKOUT1: J15.3(MCLK) R79.1 R86.2 ; off-sheet CAM_CLKOUT1
CAM_GPIO: R73.2 ; off-sheet CAM_GPIO
CAM_PWR_2: R71.2 ; off-sheet CAM_PWR_2
CAM_RESET_1: R72.2 ; off-sheet CAM_RESET_1
I2C0_SCL_PMIC: J14.5(SCL) ; off-sheet I2C0_SCL_PMIC
I2C0_SDA_PMIC: J14.6(SDA) ; off-sheet I2C0_SDA_PMIC
I2C2_SCL_M1: J15.5(SCL) ; off-sheet I2C2_SCL_M1
I2C2_SDA_M1: J15.6(SDA) ; off-sheet I2C2_SDA_M1
I2S1_LRCK_RX_M1: R80.2 ; off-sheet I2S1_LRCK_RX_M1
I2S1_SDI0_M1: R82.2 ; off-sheet I2S1_SDI0_M1
MCLK: C72.1 R86.1 R87.2 R88.1
MIPI_CSI_RX_CLK0N: J14.20(CN) ; off-sheet MIPI_CSI_RX_CLK0N
MIPI_CSI_RX_CLK0P: J14.19(CP) ; off-sheet MIPI_CSI_RX_CLK0P
MIPI_CSI_RX_CLK1N: J15.20(CN) ; off-sheet MIPI_CSI_RX_CLK1N
MIPI_CSI_RX_CLK1P: J15.19(CP) ; off-sheet MIPI_CSI_RX_CLK1P
MIPI_CSI_RX_D0N: J14.14(NO) ; off-sheet MIPI_CSI_RX_D0N
MIPI_CSI_RX_D0P: J14.13(PO) ; off-sheet MIPI_CSI_RX_D0P
MIPI_CSI_RX_D1N: J14.17(N1) ; off-sheet MIPI_CSI_RX_D1N
MIPI_CSI_RX_D1P: J14.16(P1) ; off-sheet MIPI_CSI_RX_D1P
MIPI_CSI_RX_D2N: J15.14(NO) ; off-sheet MIPI_CSI_RX_D2N
MIPI_CSI_RX_D2P: J15.13(PO) ; off-sheet MIPI_CSI_RX_D2P
MIPI_CSI_RX_D3N: J15.17(N1) ; off-sheet MIPI_CSI_RX_D3N
MIPI_CSI_RX_D3P: J15.16(P1) ; off-sheet MIPI_CSI_RX_D3P
SPI3_MISO_M0: R79.2 ; off-sheet SPI3_MISO_M0
NetC64_1: C64.1 J14.1(RST) R72.1 R77.2
NetC65_1: C65.1 J15.1(RST) R74.1 R78.2
NetC66_1: C66.1 FB2.2 R84.2 U12.1(IN)
NetC71_1: C71.1 R84.1 U12.3(EN)
NetC73_1: C73.1 FB3.2 R89.2 U14.1(IN)
NetC77_1: C77.1 FB4.2 R90.2 U15.1(IN)
NetC81_1: C81.1 R89.1 U14.3(EN)
NetC82_1: C82.1 R90.1 U15.3(EN)
NetJ14_2: J14.2(PWDN) R73.1 R76.1
NetJ15_2: J15.2(PWDN) R71.1 R75.1
NetR74_2: R74.2 R82.1
NetR85_1: R85.1 U13.1(NC)
NetR87_1: R87.1 U13.3(OUT)

Not connected (* = marked no-connect by the designer): J14 7(NC) 9(NC) 15(GND) 22(P2) 23(N2) 25(P3) 26(N3); J15 7(NC) 9(NC) 15(GND) 22(P2) 23(N2) 25(P3) 26(N3); U12 4(NC); U14 4(NC); U15 4(NC)

### Notes on the sheet
- MIPI_CSI_RX 2Lanes
- (in symbol radxa_1010) Size; Title:; REV; Page Name:; Date:; Sheet; of

### Library data of the parts
C64 C65 C71 C82 = CAP NP_0: as C42 on sheet 09; Dielectric: X5R; Created by: JJJ; Part Type: C0402; RK PN: C1005X5R1A104K050BA
C66 C74 C77 C78 = CAP NP_0: cap,10.00uF,+/-10%,10V,X5R,C0603; Manufacturer PN: C1608X5R1A106K080AC; Manufacturer: TDK; Tolerance: 10%; Priority: A; Dielectric: X5R; Created by: JJJ; Part Type: C0603; RK PN: C1608X5R1A106K080AC
C67 C73 = CAP NP_0: as C46 on sheet 09; Dielectric: X5R; Part Type: C0603; Manufacturer PN: C1608X5R1A106K080AC; Created by: JJJ
C68 C69 C75 C76 C79-C81 = CAP NP_0: as C47 on sheet 09; Dielectric: X5R; Part Type: C0402; Manufacturer PN: C1005X5R1A104K050BA; Created by: JJJ
C70 = C: 贴片陶瓷电容 0402 X5R 1uF±10% 16V; PARTS: 1; Part Number: 823030105005; PINSWAP: (A,B); LEVEL: STD; PKG_TYPE: CAP2-100-250; OriginalSymbolOrigin: (0,30); ROOM: DVDD_MEDIA; Grade: B; Approved: 已承认; Part Type: 电容
C72 = C: 贴片陶瓷电容 0402 NPO 10pF±5% 50V; PARTS: 1; Part Number: 823060100001; PINSWAP: (A,B); LEVEL: STD; PKG_TYPE: CAP2-100-250; OriginalSymbolOrigin: (0,30); ROOM: AN41908; Grade: B; Approved: 已承认; Part Type: 电容
FB2 FB3 = FB: 贴片磁珠 0603 600Ω±25% 1000mA 铁氧体叠片 UPZ1608E601-1R0T 顺络; Part Number: 832026000003; Approved: 已承认; Grade: D; Part Type: 磁珠
FB4 = FB: 贴片磁珠 0603 600Ω±25% 1000mA 铁氧体叠片 UPZ1608E601-1R0T 顺络; Part Number: 832026000003; Grade: D; Approved: 已承认; Part Type: 磁珠
J14 = com40pin_0_2
J15 = com40pin_0_1
R71-R73 R76 R77 = R: 贴片电阻 0805 0Ω±5%; PARTS: 1; Part Number: 811040000001; OriginalSymbolOrigin: (10,20); PINSWAP: (A,B); PKG_TYPE: 2; LEVEL: STD; ROOM: DC-IRIS; Grade: B; Approved: 已承认; Part Type: 电阻
R74 R75 R78 R85 = R: 贴片电阻 0805 0Ω±5%; PARTS: 1; Part Number: 811040000001; OriginalSymbolOrigin: (10,20); PINSWAP: (A,B); PKG_TYPE: 2; LEVEL: STD; Approved: 已承认; Grade: B; ROOM: DC-IRIS; Part Type: 电阻
R79 R86 R88 R90 = RESISTOR_0: as R28 on sheet 07; Created by: YTL; Part Type: 通用厚膜电阻; RK PN: RC0402JR-07100RL
R80 R82 R84 R89 = RESISTOR_0: as R9212 on sheet 06; Part Type: 通用厚膜电阻; Manufacturer PN: RC0402JR-07100RL; Created by: YTL
R87 = R: 贴片电阻 0402 33Ω±5%; PARTS: 1; Part Number: 811020330001; OriginalSymbolOrigin: (10,20); PINSWAP: (A,B); PKG_TYPE: 2; LEVEL: STD; ROOM: AN41908; Grade: B; Approved: 已承认; Part Type: 电阻
U12 U14 U15 = AP7331-18WG
U13 = OSC_4PIN_1: 贴片钟振 27.000MHz ±30PPM  3.3V 3.2x2.5mm; Part Number: 841042700403; Grade: B; Approved: 已承认; ROOM: AN41908; Part Type: 钟振
*#10 = radxa_1010: Page Create Date: March  8, 1995